# EasyEDA Pro project Homework_1.eprj

# Schematic Schematic1

## Sheets
1 Nguồn: Board Name: Board1; Create Date: 2026-03-27; Page Name: P1; Project Name: Homework_1; Schematic Name: Schematic1; Update Date: 2026-04-17; Company: Lê Huy; Page Size: A4; Version: V1.0
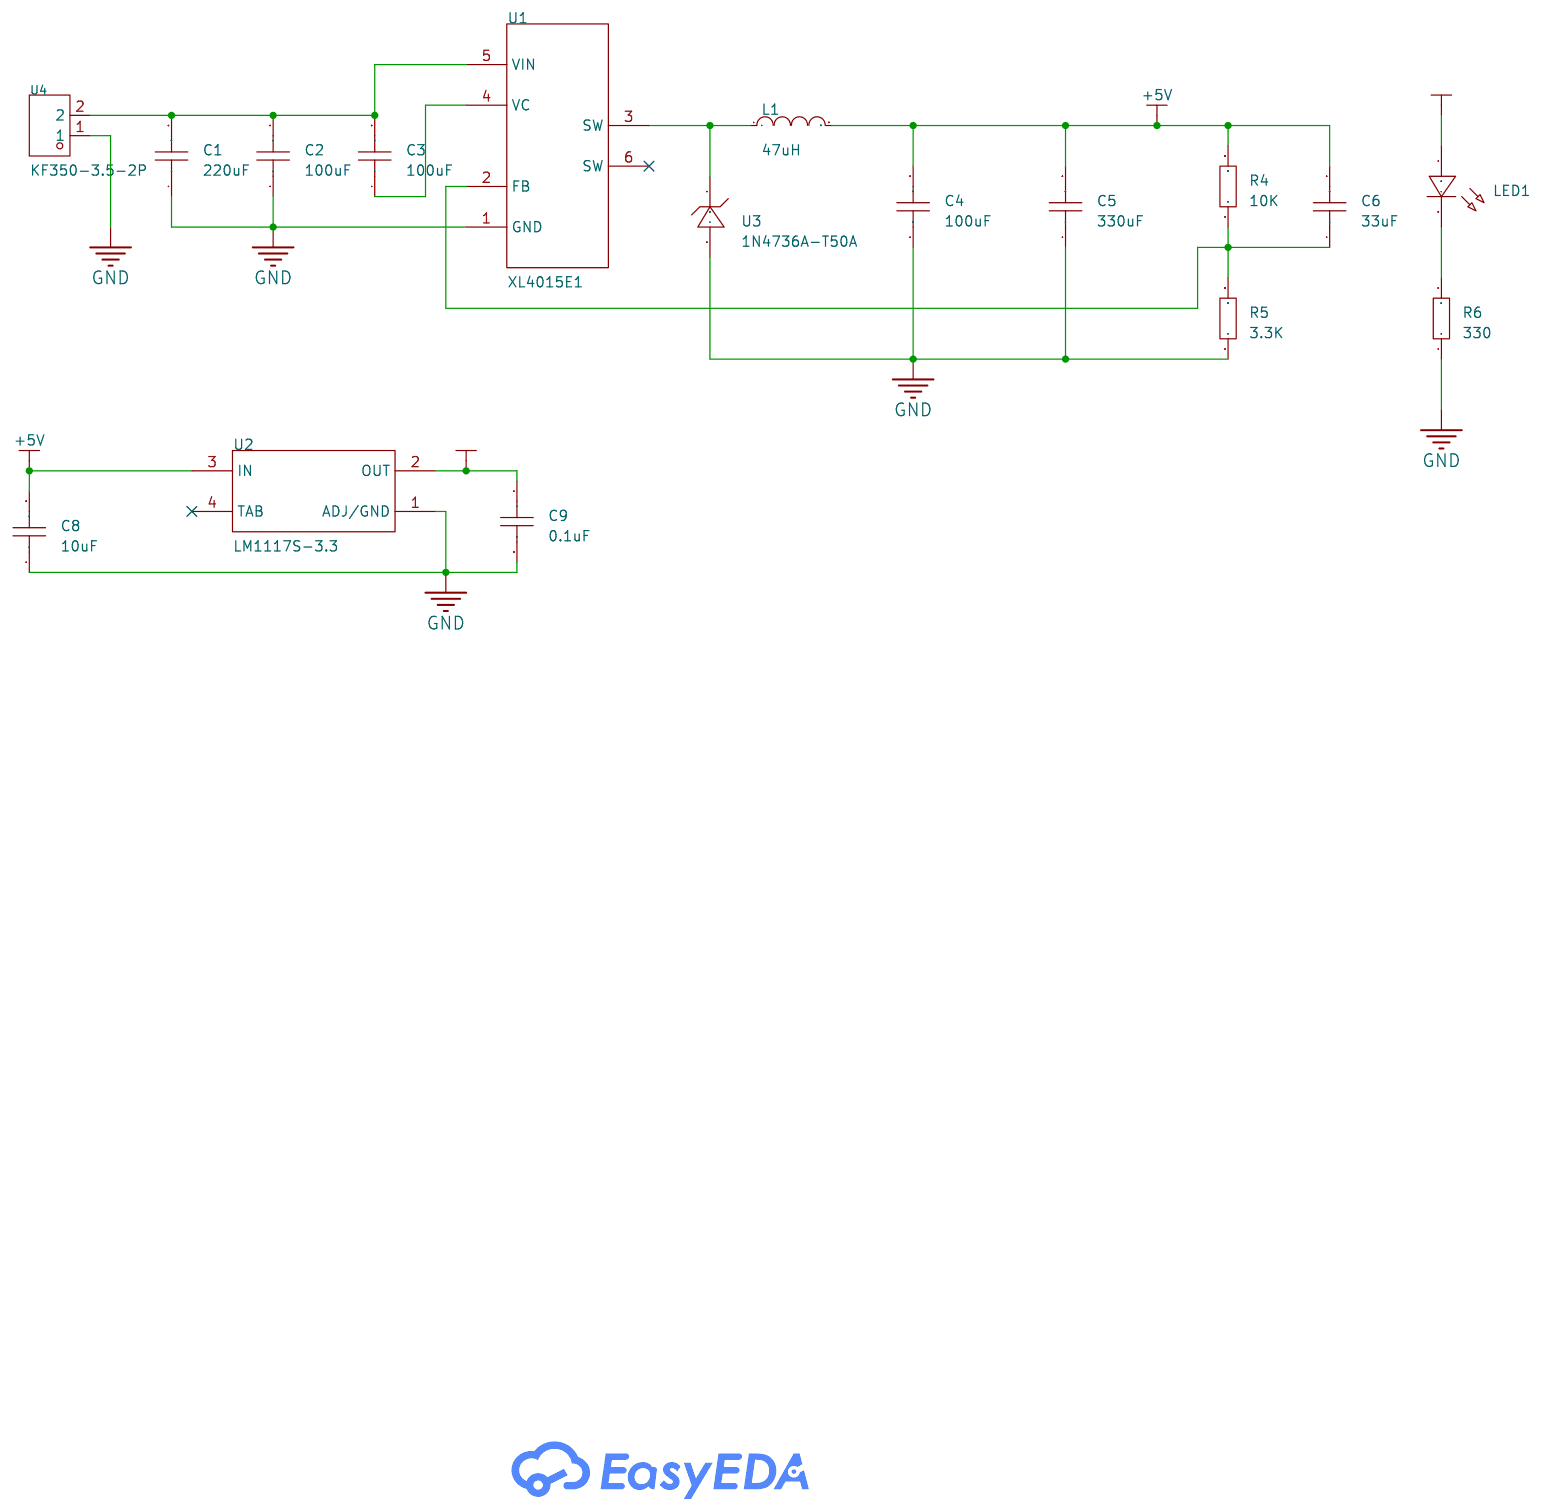
[diagram p0: Nguồn]
2 Não: Create Date: 2026-04-16; Page Name: Não; Update Date: 2026-05-25; Company: EasyEDA.com
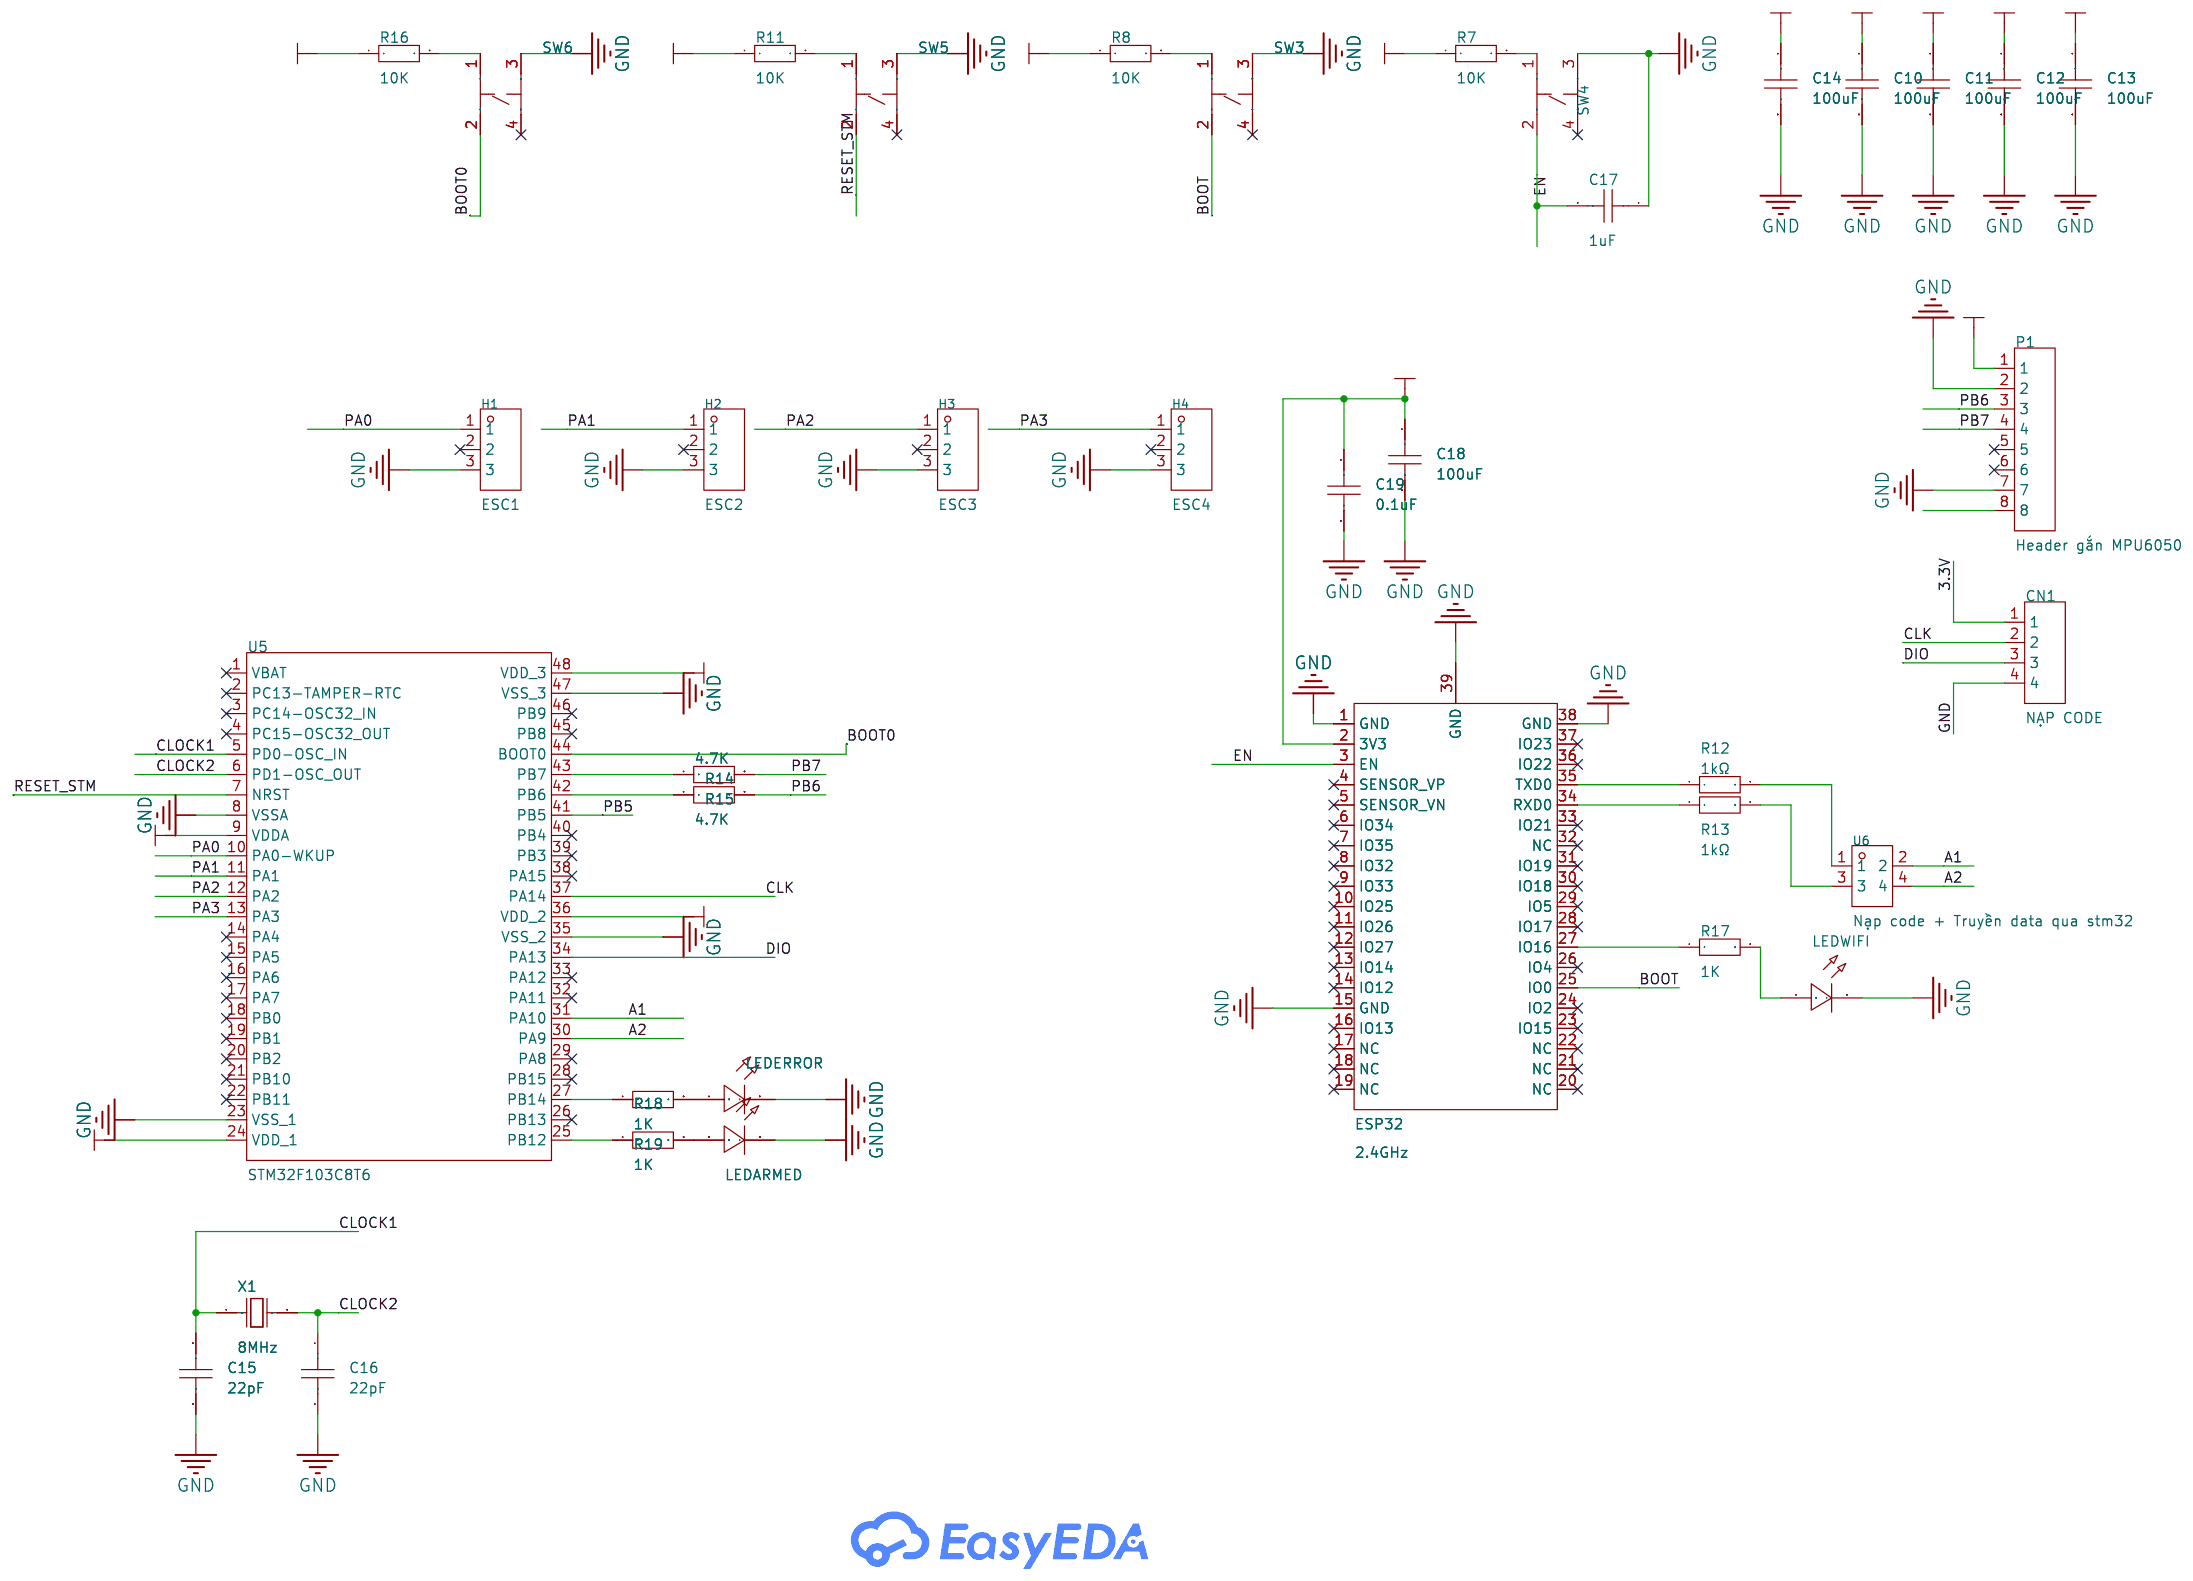
[diagram p1: Não]

## Parts
sheet Nguồn
C1  220uF  [C0805]
C2  100uF  [C0805]
C3  100uF  [C0805]
C4  100uF  [C0805]
C5  330uF  [C0805]
C6  33uF  [C0805]
C8  10uF  [C0805]
C9  0.1uF  [C0805]
L1  47uH  [L0805]
LED1  -  [LED-TH_BD3.0-P2.54-FD]
R4  10K  [R0805]
R5  3.3K  [R0805]
R6  330  [R0805]
U1  XL4015E1  [TO-263-5_L10.2-W8.9-P1.70-TL]
U2  LM1117S-3.3  [SOT-223-3_L6.5-W3.4-P2.30-LS7.0-BR]
U3  1N4736A-T50A  [DO-41_BD2.4-L4.7-P8.70-D0.9-RD]
U4  KF350-3.5-2P  [CONN-TH_P3.50_KF350-3.5-2P]
sheet Não
C10  100uF  [C0805]
C11  100uF  [C0805]
C12  100uF  [C0805]
C13  100uF  [C0805]
C14  100uF  [C0805]
C15  22pF  [C0805]
C16  22pF  [C0805]
C17  1uF  [C0805]
C18  100uF  [C0805]
C19  0.1uF  [C0805]
CN1  NẠP CODE  [CONN-TH_XY-XH2.54-4A11-YT]
ESP32  2.4GHz  [WIFI-SMD_ESP32-WROOM-32E]
H1  ESC1  [HDR-TH_3P-P2.54-V-M-1]
H2  ESC2  [HDR-TH_3P-P2.54-V-M-1]
H3  ESC3  [HDR-TH_3P-P2.54-V-M-1]
H4  ESC4  [HDR-TH_3P-P2.54-V-M-1]
LEDARMED  -  [LED-TH_BD3.0-P2.54-FD]
LEDERROR  -  [LED-TH_BD3.0-P2.54-FD]
LEDWIFI  -  [LED-TH_BD3.0-P2.54-FD]
P1  Header gắn MPU6050  [HDR-TH_8P-P2.54-V-F]
R7  10K  [R0805]
R8  10K  [R0805]
R11  10K  [R0805]
R12  1kΩ  [R_AXIAL-0.4]
R13  1kΩ  [R_AXIAL-0.4]
R14  4.7K  [R0805]
R15  4.7K  [R0805]
R16  10K  [R0805]
R17  1K  [R0805]
R18  1K  [R0805]
R19  1K  [R0805]
SW3  BOOT  [SW-SMD_4P-L6.0-W6.0-P4.50-LS9.0-H7.3]
SW4  SW  [SW-SMD_4P-L6.0-W6.0-P4.50-LS9.0-H7.3]
SW5  BOOT  [SW-SMD_4P-L6.0-W6.0-P4.50-LS9.0-H7.3]
SW6  BOOT  [SW-SMD_4P-L6.0-W6.0-P4.50-LS9.0-H7.3]
U5  STM32F103C8T6  [LQFP-48_L7.0-W7.0-P0.50-LS9.0-BL]
U6  Nạp code + Truyền data qua stm32  [HDR-TH_4P-P2.54-V-M-R2-C2-S2.54]
X1  8MHz  [HC-49S_L11.0-W4.7-P4.88]

## Library data of the parts
C1-C6 C8-C19 = CAP_0805: Supplier Footprint: 0805
L1 = L_0805
LED1 LEDARMED LEDERROR LEDWIFI = LED_TH-R_3mm: Supplier Footprint: Through
R4-R8 R11 R14-R19 = Res_0805: Supplier Footprint: 0805
U1 = XL4015E1: LCSC Part Name: 5A 180KHz 36V 降压型DC-DC转换器; Supplier Part: C51661; Manufacturer: XLSEMI(芯龙); Supplier Footprint: TO-263-5; JLCPCB Part Class: Extended Part; Datasheet: https://item.szlcsc.com/datasheet/XL4015E1/52674.html; Supplier: LCSC; Function: Buck; Voltage - Supply: 8V~36V; Output Voltage: 1.25V~32V; Output Current: 5A; Frequency - Switching: 180kHz; Operating Temperature: -40℃~+125℃; Synchronous Rectifier: No; Number of Outputs: 1; Topology: Buck; Quiescent Current: 5mA; Switch tube (built-in/external): Built-in; Output Type: Adjustable
U2 = LM1117S-3.3: LCSC Part Name: 输入12V 输出3.3V 1A; Supplier Part: C126027; Manufacturer: HTC; Supplier Footprint: SOT-223-3; JLCPCB Part Class: Extended Part; Datasheet: https://item.szlcsc.com/datasheet/LM1117S-3.3/137307.html; Supplier: LCSC; Output Type: Fixed; Voltage - Supply: 12V; Output Voltage: 3.3V; Output Current: 1A; Power Supply Rejection Ratio (PSRR): 75dB@(120Hz); Voltage Dropout: 1.2V@(1A); standby current: 5mA; Noise: 100uV; Features: Over Temperature Protection; Operating Temperature: -40℃~+125℃@(Tj); Output Configuration: Positive; Number of Outputs: 1
U3 = 1N4736A-T50A: LCSC Part Name: Zener 1W 5%; Supplier Part: C890055; Manufacturer: onsemi(安森美); Supplier Footprint: 插件,D2.03xL4.06mm; JLCPCB Part Class: Extended Part; Datasheet: https://atta.szlcsc.com/upload/public/pdf/source/20221020/ED14C0897A7B8AED5ABCCF0A94CC169C.pdf; Supplier: LCSC; Zener Voltage (Nom): 6.8V; Reverse Leakage Current (Ir): 10uA@4V; Power Dissipation: 1W; Zener Impedance (Zzt): 3.5Ω
U4 = KF350-3.5-2P: LCSC Part Name: 3.5mm 1x2P 排数:1 每排P数:2 直插; Supplier Part: C474892; Manufacturer: KEFA(科发); Supplier Footprint: 插件,P=3.5mm; JLCPCB Part Class: Extended Part; Datasheet: https://atta.szlcsc.com/upload/public/pdf/source/20230317/986DB56DD49619EA586AA8816AA9D164.pdf; Supplier: LCSC; Structure: 1x2P; Pitch: 3.5mm; Color: Green; Mounting Style: Straight; Current Rating (Max): 10A; Voltage Rating (Max): 300V; Number of Pins: 2P; Number of Rows: 1; Wire Gauge - AWG: 18~24; Wire Gauge - mm2: 0.75; Number of PINs Per Row: 2; Operating Temperature Range: -40℃~+105℃
CN1 = HC-XH2.54-4A-M: LCSC Part Name: 1x4P 间距:2.5mm 直插 系列:XH; Supplier Part: C53454747; Manufacturer: HC(虹成电子); Supplier Footprint: 插件,P=2.5mm; JLCPCB Part Class: Extended Part; Datasheet: https://item.szlcsc.com/datasheet/HC-XH2.54-4A-M/56613753.html; Supplier: LCSC; Pins Structure: 1x4P; Pitch: 2.5mm; Mounting Type: Through Hole; Reference Series: XH; Number of Pins: 4P; Number of Rows: 1; Number of PINs Per Row: 4; Current Rating: 3A; Contact Material: Copper; Contact Plating: Tin; Operating Temperature: -25℃~+85℃; Voltage Rating: 250V; Plastic Material: PA66; Color: Beige; Z-Height of the Board: 7mm; X-Length of Bottom Edge on Board (Spacing Line): 12.5mm; Y-Width of Bottom Edge on Board: 5.8mm
ESP32 = ESP32-WROOM-32E-N4: LCSC Part Name: 不带固件 通用型Wi-Fi+BT+BLE MCU模组; Supplier Part: C701341; Manufacturer: ESPRESSIF(乐鑫); Supplier Footprint: SMD,25.5x18mm; JLCPCB Part Class: Extended Part; Datasheet: https://item.szlcsc.com/datasheet/ESP32-WROOM-32E-N4/736349.html; Supplier: LCSC; Utilized IC / Part: ESP32-D0WDR2-V3；ESP32-D0WD-V3; Wireless Standard: Bluetooth4.2; Interface Type: I2C；GPIO；UART；SPI；SDIO; Antenna Type: On-board PCB Antenna; Output Power: 20dBm; Voltage - Supply: 3V~3.6V; Receive  Current: 112mA; Send  Current: 239mA; Sensitivity: -98dBm; Operating Temperature: -40℃~+85℃
H1-H4 = 2.54-1*3: LCSC Part Name: 停产 1x3P 间距:2.54mm 方针 直插; Supplier Part: C5116482; Manufacturer: ZHOURI(洲日); Supplier Footprint: 插件,P=2.54mm; JLCPCB Part Class: Extended Part; Datasheet: https://item.szlcsc.com/datasheet/2.54-1*3/5692725.html; Supplier: LCSC; Pin Structure: 1x3P; Pitch: 2.54mm; Circluar Pins/Square Pins: Pin Header; Mounting Type: Through Hole; Number of Rows: 1; Number of Pins: 3P; Current Rating: 2.5A; Length of Mating Pin: 6mm; Insulation Height: 2.54mm; Length of End Connection Pin: 3mm; Contact Material: Brass; Contact Plating: Gold; Operating Temperature: -40℃~+105℃
P1 = 2.54-1*8P母环保: LCSC Part Name: 1x8P 间距:2.54mm 直插; Supplier Part: C27438; Manufacturer: BOOMELE(博穆精密); Supplier Footprint: 插件,P=2.54mm; JLCPCB Part Class: Extended Part; Datasheet: https://item.szlcsc.com/datasheet/2.54-1*8P%25E6%25AF%258D%25E7%258E%25AF%25E4%25BF%259D/28187.html; Supplier: LCSC; Holes Structure: 1x8P; Pitch: 2.54mm; Circular Hole / Square Hole: Square Hole; Mounting Type: Through Hole; Number of Rows: 1; Number of Positions: 8P; Current Rating: 3A; Holes Direction: Top; Insulation Height: 8.5mm; Contact Material: Brass; Contact Plating: Gold; Operating Temperature: -55℃~+105℃; PIN Length: 3.2mm
R12 R13 = Res_AXIAL-1/4W: Supplier Footprint: Through
SW3-SW6 = HX-6x6x7.3-TP FT square button: LCSC Part Name: 6*6*7.3mm贴片 方头 轻触开关; Supplier Part: C49234152; Manufacturer: hanxia(韩下); Supplier Footprint: SMD,6x6mm; JLCPCB Part Class: Extended Part; Datasheet: https://item.szlcsc.com/datasheet/HX-6x6x7.3-TP%2520FT%2520square%2520button/51650213.html; Supplier: LCSC; Circuit: SPST; Actuator Style: Round Button; Operating Force: 2.5N; Mounting Type: Surface Mount,Vertical; Length: 6mm; Width: 6mm; Switch Height: 7.3mm; with Bracket: Without Bracket; Contact Current: 50mA; Voltage Rating: 250V; Actuator/Cap Color: Black; With Lamp: No; Termination Style: SMD(SMT) Tab; Life: 100,000 Cycles; Operating Temperature: -25℃~+70℃
U5 = STM32F103C8T6: LCSC Part Name: 主流增强型ARM Cortex-M3 MCU，具有64 KB Flash、72 MHz CPU、电机控制、USB和CAN; Supplier Part: C8734; Manufacturer: ST(意法半导体); Supplier Footprint: LQFP-48(7x7); JLCPCB Part Class: Extended Part; Datasheet: https://item.szlcsc.com/datasheet/STM32F103C8T6/9243.html; Supplier: LCSC; CPU Core: ARM-M3; CPU Maximum Speed: 72MHz; Program Storage Size: 64KB; Program Memory Type: FLASH; Number of I/O: 37; ADC (Bit): 12bit; Voltage - Supply: 2V~3.6V
U6 = PZ2.54-2*2: LCSC Part Name: 2x2P 间距:2.54mm 方针 直插; Supplier Part: C5156675; Manufacturer: ZHOURI(洲日); Supplier Footprint: 插件,P=2.54mm; JLCPCB Part Class: Extended Part; Datasheet: https://item.szlcsc.com/datasheet/PZ2.54-2*2/5790844.html; Supplier: LCSC; Pin Structure: 2x2P; Pitch: 2.54mm; Row Spacing: 2.54mm; Circluar Pins/Square Pins: Pin Header; Mounting Type: Through Hole; Number of Rows: 2; Number of Pins: 4P; Current Rating: 2.5A; Length of Mating Pin: 6mm; Insulation Height: 2.54mm; Length of End Connection Pin: 3mm; Contact Material: Brass; Contact Plating: Gold; Operating Temperature: -40℃~+105℃
X1 = 049ST2-8.000F16HPNLL: LCSC Part Name: NJHP HC-49S 2P 8MHz 16pF ±10ppm -20~+70℃(±30ppm); Supplier Part: C46598389; Manufacturer: HCI(杭晶); Supplier Footprint: HC-49S-2P; JLCPCB Part Class: Extended Part; Datasheet: https://item.szlcsc.com/datasheet/049ST2-8.000F16HPNLL/48741025.html; Supplier: LCSC; Type: Through Hole Crystal Oscillator; Normal temperature Frequency Tolerance: ±10ppm; Load Capacitance: 16pF; Frequency Stability: ±20ppm; Equivalent Series Resistance(ESR): 60Ω; Operating Temperature: -20℃~+70℃

## Nets
3.3V: C9.1 C10.1 C11.1 C12.1 C13.1 C14.1 C18.1 C19.1 CN1.1 ESP32.2(3V3) LED1.1(C) P1.1 R7.1 R8.1 R11.1 R16.1 U2.2(OUT) U5.9(VDDA) U5.24(VDD_1) U5.36(VDD_2) U5.48(VDD_3)
+5V: C4.2 C5.2 C6.2 C8.2 L1.2 R4.2 U2.3(IN)
GND: C1.1 C2.1 C4.1 C5.1 C8.1 C9.2 C10.2 C11.2 C12.2 C13.2 C14.2 C15.2 C16.2 C17.1 C18.2 C19.2 CN1.4 ESP32.1(GND) ESP32.15(GND) ESP32.38(GND) ESP32.39(GND) H1.3 H2.3 H3.3 H4.3 LEDARMED.2(A) LEDERROR.2(A) LEDWIFI.2(A) P1.2 P1.7 R5.1 R6.1 SW3.3(C) SW4.3(C) SW5.3(C) SW6.3(C) U1.1(GND) U2.1(ADJ/GND) U3.2(A) U4.1 U5.8(VSSA) U5.23(VSS_1) U5.35(VSS_2) U5.47(VSS_3)
A1: U5.31(PA10) U6.2
A2: U5.30(PA9) U6.4
BOOT: ESP32.25(IO0) SW3.2(B)
BOOT0: SW6.2(B) U5.44(BOOT0)
CLK: CN1.2 U5.37(PA14)
CLOCK1: C15.1 U5.5(PD0-OSC_IN) X1.1(OSC1)
CLOCK2: C16.1 U5.6(PD1-OSC_OUT) X1.2(OSC2)
DIO: CN1.3 U5.34(PA13)
EN: C17.2 ESP32.3(EN) SW4.2(B)
PA0: H1.1 U5.10(PA0-WKUP)
PA1: H2.1 U5.11(PA1)
PA2: H3.1 U5.12(PA2)
PA3: H4.1 U5.13(PA3)
PB5: U5.41(PB5)
PB6: P1.3 R15.2
PB7: P1.4 R14.2
RESET_STM: SW5.2(B) U5.7(NRST)
$1N753: C1.2 C2.2 C3.2 U1.5(VIN) U4.2
$1N844: C3.1 U1.4(VC)
$1N850: L1.1 U1.3(SW) U3.1(C)
$1N1078: C6.1 R4.1 R5.2 U1.2(FB)
$1N1506: LED1.2(A) R6.2
$2N3717: ESP32.35(TXD0) R12.1
$2N3721: ESP32.34(RXD0) R13.1
$2N4329: R8.2 SW3.1(A)
$2N4589: R7.2 SW4.1(A)
$2N4702: R11.2 SW5.1(A)
$2N7245: R12.2 U6.1
$2N7250: R13.2 U6.3
$2N8541: R14.1 U5.43(PB7)
$2N8545: R15.1 U5.42(PB6)
$2N11841: R16.2 SW6.1(A)
$2N11851: ESP32.27(IO16) R17.1
$2N11902: LEDWIFI.1(C) R17.2
$2N12058: LEDERROR.1(C) R18.2
$2N12127: LEDARMED.1(C) R19.2
$2N12132: R18.1 U5.27(PB14)
$2N12136: R19.1 U5.25(PB12)

Not connected (* = marked no-connect by the designer): ESP32 4(SENSOR_VP)* 5(SENSOR_VN)* 6(IO34)* 7(IO35)* 8(IO32)* 9(IO33)* 10(IO25)* 11(IO26)* 12(IO27)* 13(IO14)* 14(IO12)* 16(IO13)* 17(NC)* 18(NC)* 19(NC)* 20(NC)* 21(NC)* 22(NC)* 23(IO15)* 24(IO2)* 26(IO4)* 28(IO17)* 29(IO5)* 30(IO18)* 31(IO19)* 32(NC)* 33(IO21)* 36(IO22)* 37(IO23)*; H1 2*; H2 2*; H3 2*; H4 2*; P1 5* 6* 8; SW3 4(D)*; SW4 4(D)*; SW5 4(D)*; SW6 4(D)*; U1 6(SW)*; U2 4(TAB)*; U5 1(VBAT)* 2(PC13-TAMPER-RTC)* 3(PC14-OSC32_IN)* 4(PC15-OSC32_OUT)* 14(PA4)* 15(PA5)* 16(PA6)* 17(PA7)* 18(PB0)* 19(PB1)* 20(PB2)* 21(PB10)* 22(PB11)* 26(PB13)* 28(PB15)* 29(PA8)* 32(PA11)* 33(PA12)* 38(PA15)* 39(PB3)* 40(PB4)* 45(PB8)* 46(PB9)*

# Board PCB5
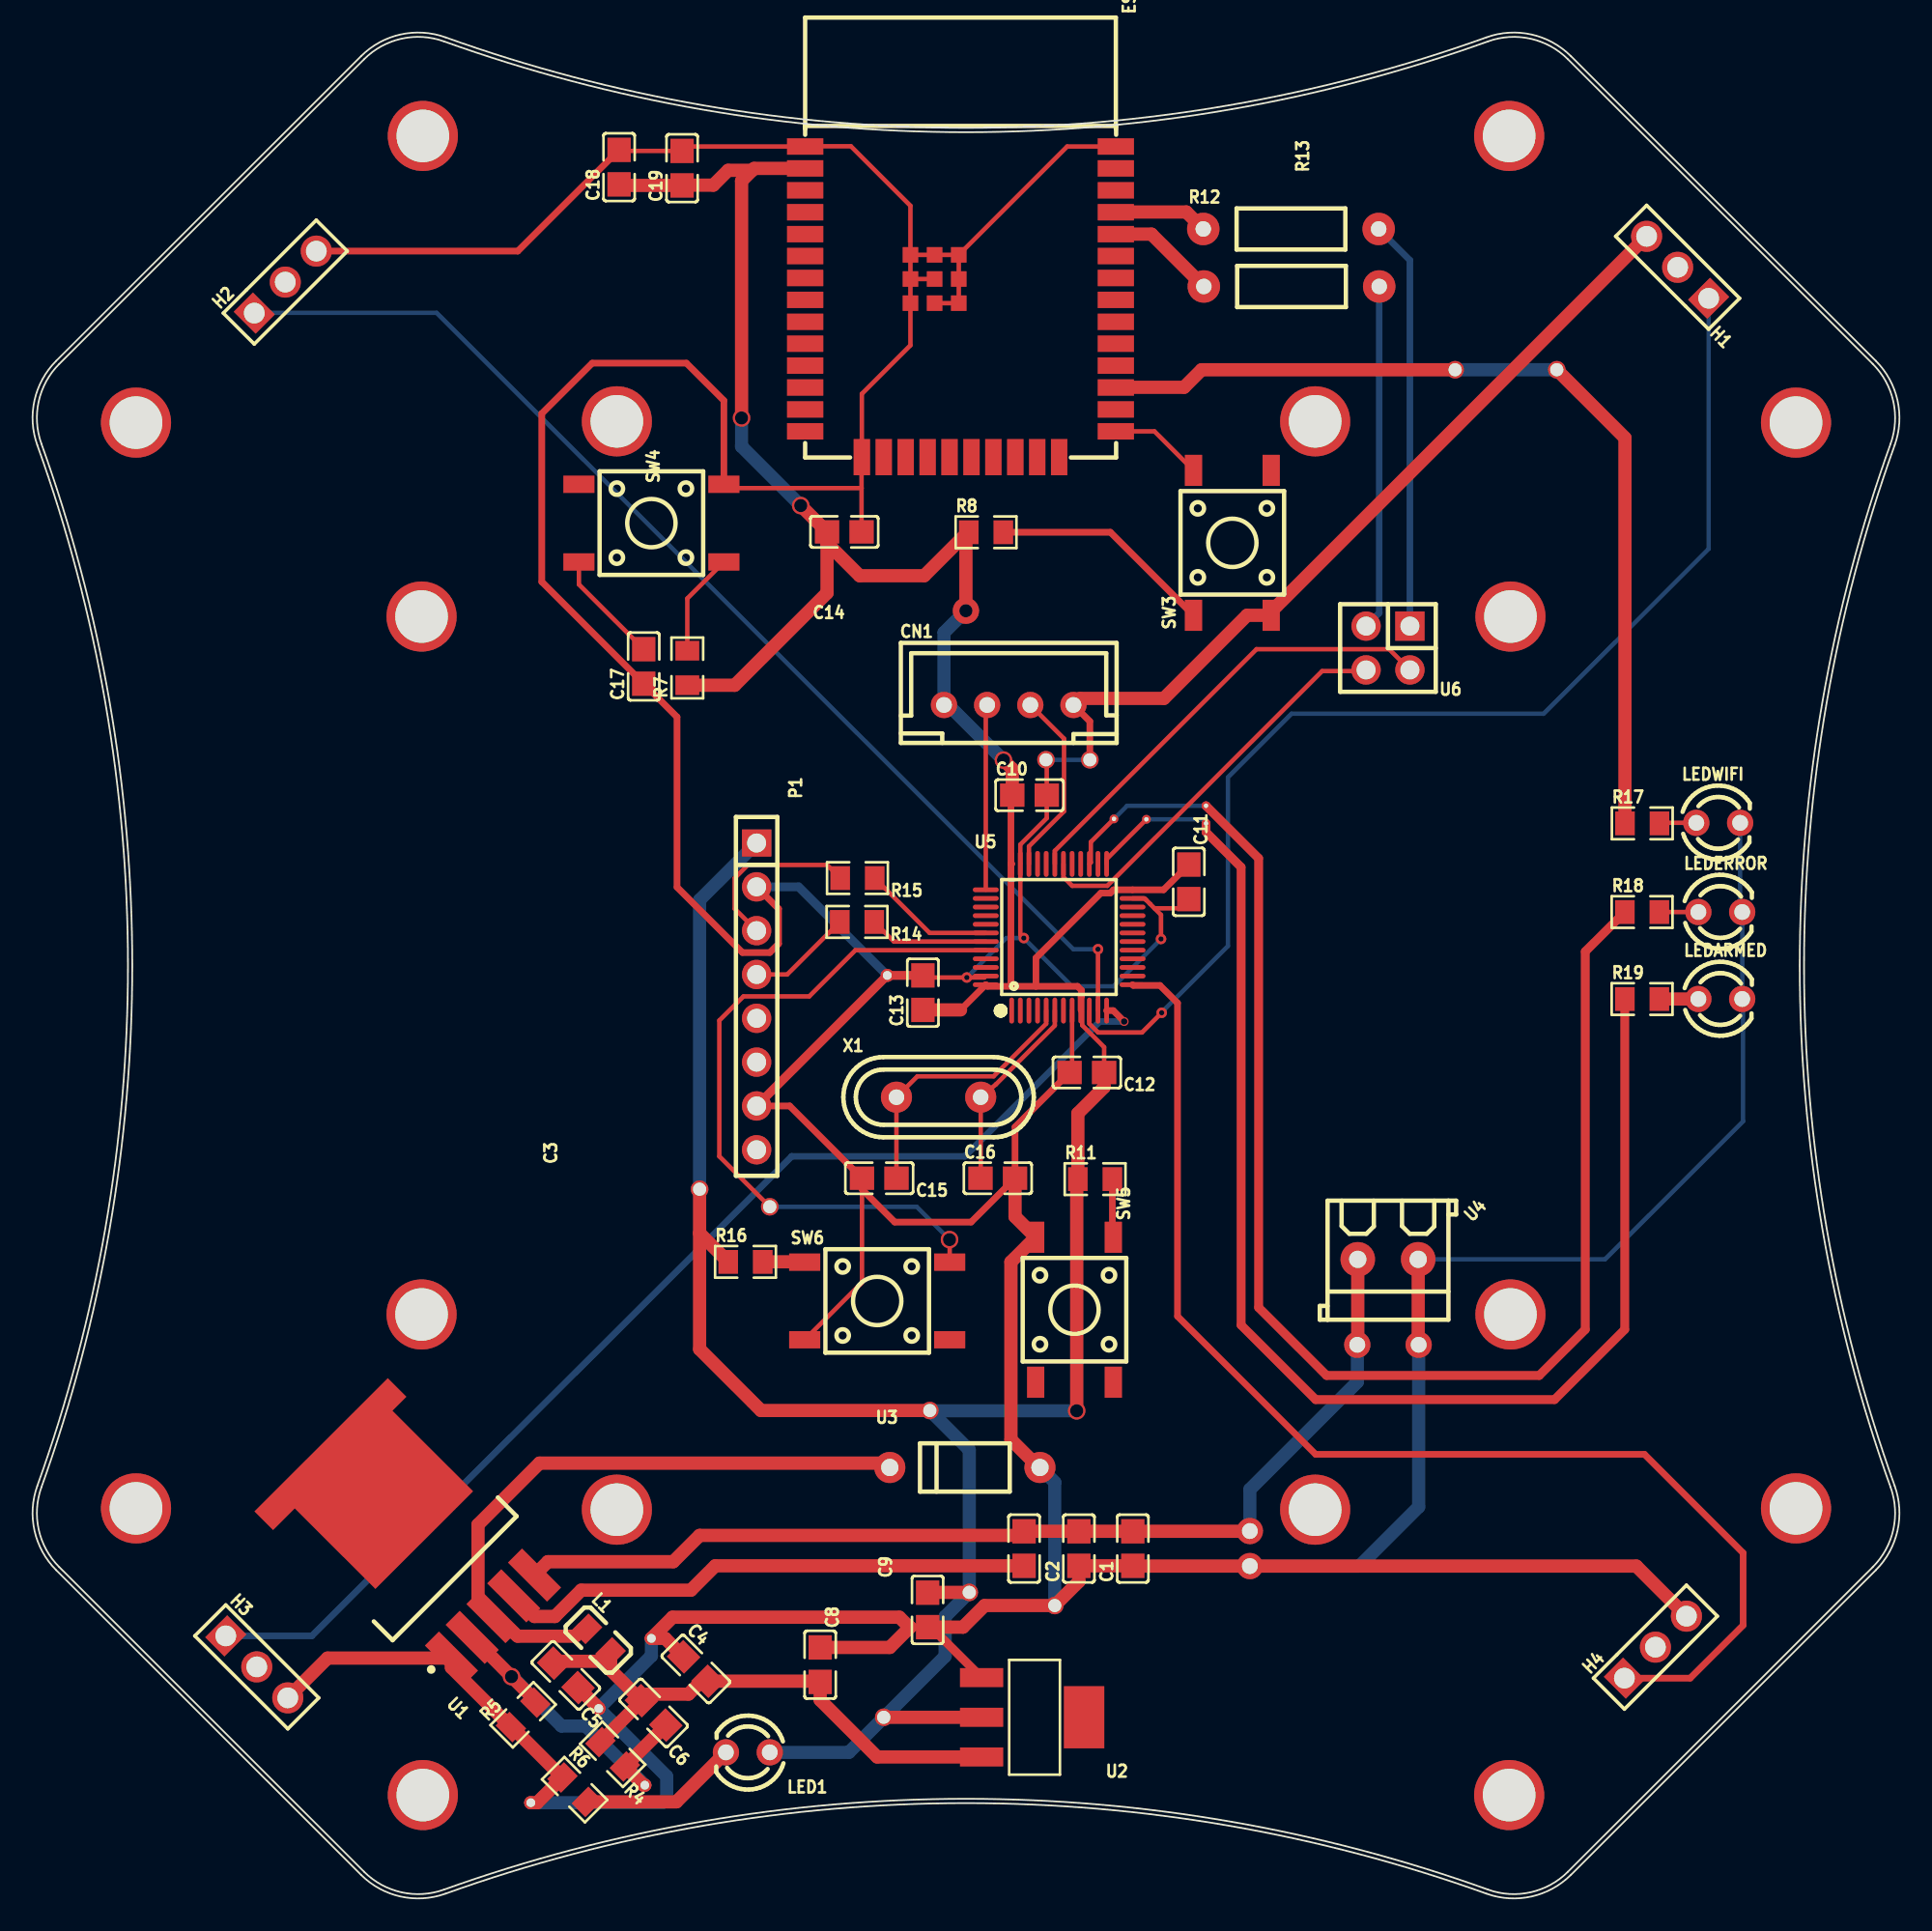
[diagram p2: board, top side]
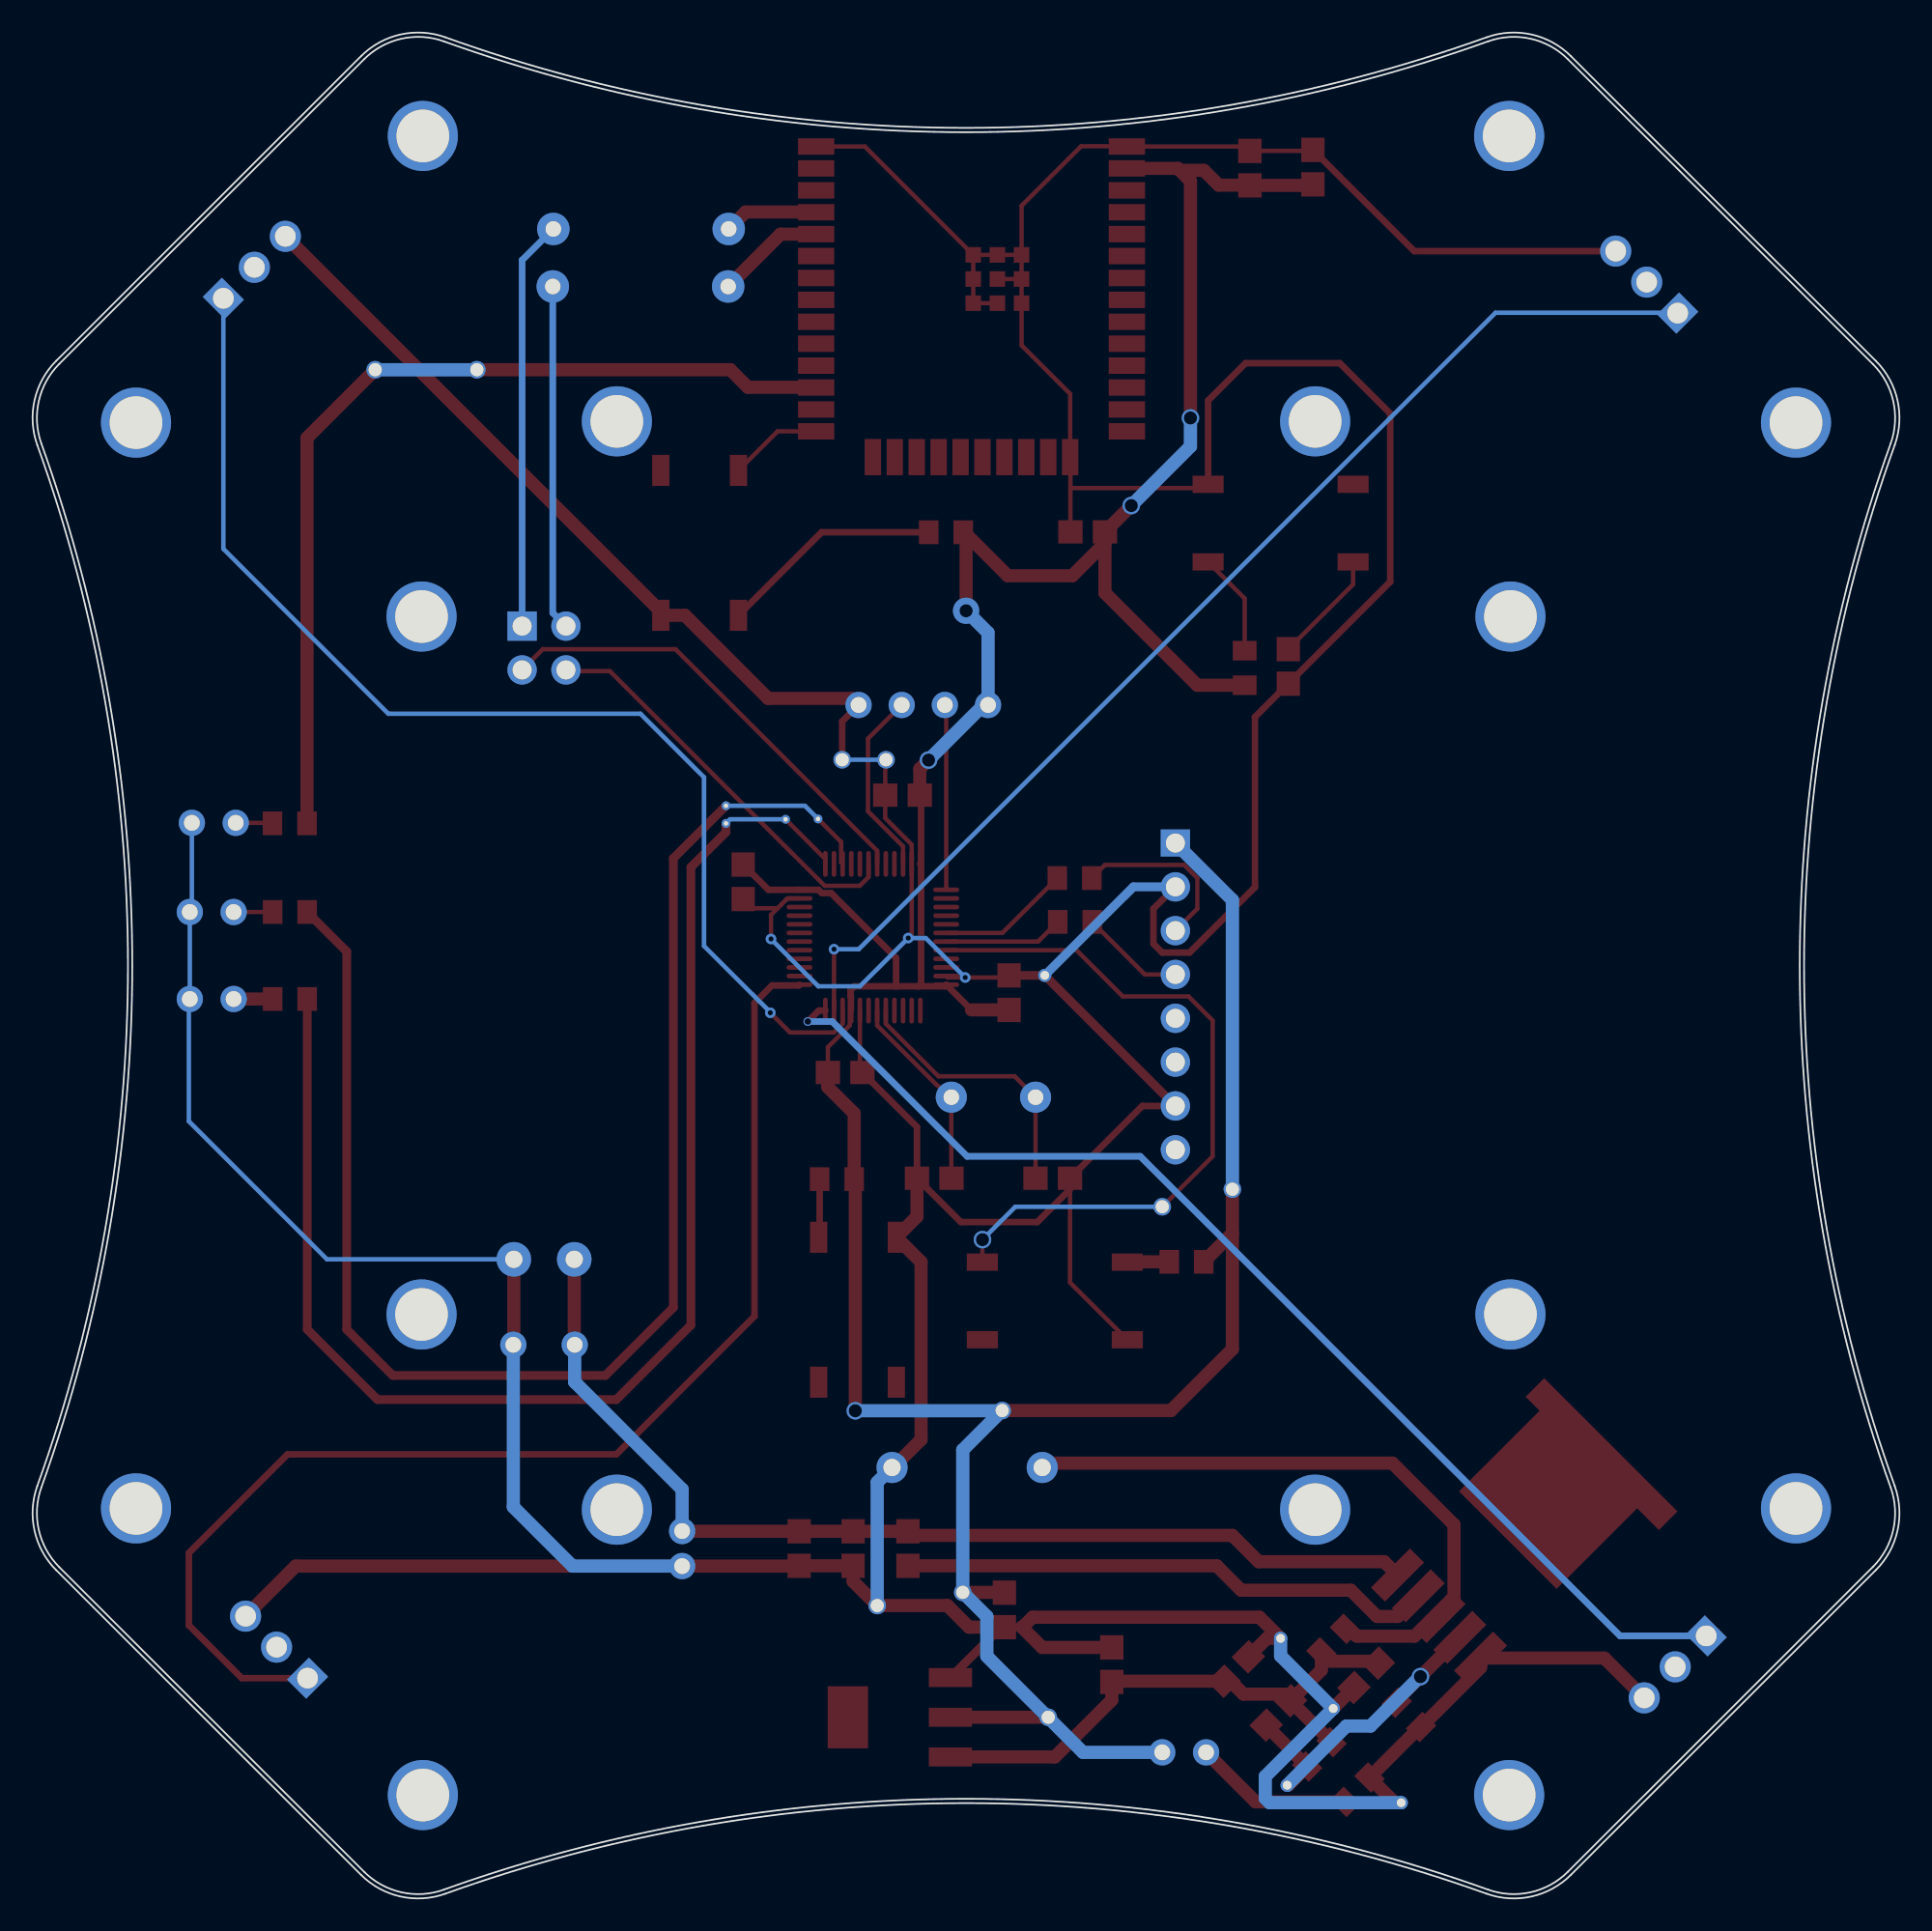
[diagram p3: board, bottom side, seen from below]

Outline 108.15 x 108.15 mm; copper layers: Top Layer, Bottom Layer. Coordinates in mm from the lower left corner of the outline.
Outline path: 0.27,84.23 arc(5.52,54.07) 0.27,23.91 arc(0.11,21.31) 1.37,19.03 19.03,1.37 arc(21.31,0.11) 23.91,0.27 arc(54.07,5.52) 84.23,0.27 arc(86.83,0.11) 89.12,1.37 106.78,19.03 arc(108.03,21.31) 107.87,23.91 arc(102.62,54.07) 107.87,84.23 arc(108.03,86.83) 106.78,89.12 89.12,106.78 arc(86.83,108.03) 84.23,107.87 arc(54.07,102.62) 23.91,107.87 arc(21.31,108.03) 19.03,106.78 1.37,89.12 arc(0.11,86.83) 0.27,84.23 ; 0.51,84.32 arc(5.77,54.07) 0.51,23.83 arc(0.35,21.36) 1.54,19.2 19.2,1.54 arc(21.36,0.35) 23.83,0.51 arc(54.07,5.77) 84.32,0.51 arc(86.78,0.35) 88.94,1.54 106.6,19.2 arc(107.79,21.36) 107.64,23.83 arc(102.37,54.07) 107.64,84.32 arc(107.79,86.78) 106.6,88.94 88.94,106.6 arc(86.78,107.79) 84.32,107.64 arc(54.07,102.37) 23.83,107.64 arc(21.36,107.79) 19.2,106.6 1.54,88.94 arc(0.35,86.78) 0.51,84.32
Stack: Top Layer 0.035mm / Dielectric1 1.51mm FR4 er 4.5 / Bottom Layer 0.035mm

## Design rules (mm)
template: Custom Config
spacing copperThickness1oz (default): track to track 0.102, other pairs 0.152 to 0.3
spacing copperThickness2oz: track to track 0.203, other pairs 0.152 to 0.3
track width copperThickness1oz (default): min 0.127, default 0.254, max 2.54
track width copperThickness2oz: min 0.203, default 0.254, max 2.54
differential pair differentialPair (default): width min 0.127, default 0.254, max 2.54; gap min 0.152, default 0.152
via viaSize (default): diameter min 0.5, default 0.61, max 10; hole min 0.3, default 0.305, max 6.3

## Placement (name value [footprint] x y rotation side)
C1  220uF  [C0805]  63.74 20.28 90 top
C2  100uF  [C0805]  60.61 20.28 90 top
C3  100uF  [C0805]  57.44 20.28 90 top
C4  100uF  [C0805]  38.42 13.29 315 top
C5  330uF  [C0805]  30.89 12.93 135 top
C6  33uF  [C0805]  35.97 10.75 135 top
C8  10uF  [C0805]  45.63 13.55 270 top
C9  0.1uF  [C0805]  51.85 16.72 270 top
C10  100uF  [C0805]  57.75 63.95 0 top
C11  100uF  [C0805]  66.98 58.92 270 top
C12  100uF  [C0805]  61.07 47.87 180 top
C13  100uF  [C0805]  51.58 52.5 90 top
C14  100uF  [C0805]  47.02 79.2 0 top
C15  22pF  [C0805]  49.05 41.74 180 top
C16  22pF  [C0805]  55.91 41.74 0 top
C17  1uF  [C0805]  35.4 71.41 90 top
C18  100uF  [C0805]  33.97 100.35 90 top
C19  0.1uF  [C0805]  37.62 100.29 90 top
CN1  NẠP CODE  [CONN-TH_XY-XH2.54-4A11-YT]  56.55 69.17 0 top
ESP32  2.4GHz  [WIFI-SMD_ESP32-WROOM-32E]  53.75 92.54 270 top
H1  ESC1  [HDR-TH_3P-P2.54-V-M-1]  95.3 94.54 135 top
H2  ESC2  [HDR-TH_3P-P2.54-V-M-1]  14.64 93.68 45 top
H3  ESC3  [HDR-TH_3P-P2.54-V-M-1]  12.99 13.42 315 top
H4  ESC4  [HDR-TH_3P-P2.54-V-M-1]  94.01 14.56 45 top
L1  47uH  [L0805]  32.8 14.94 315 top
LED1  -  [LED-TH_BD3.0-P2.54-FD]  41.43 8.47 180 top
LEDARMED  -  [LED-TH_BD3.0-P2.54-FD]  97.77 52.13 0 top
LEDERROR  -  [LED-TH_BD3.0-P2.54-FD]  97.77 57.17 0 top
LEDWIFI  -  [LED-TH_BD3.0-P2.54-FD]  97.65 62.34 0 top
NOREF  -  [Pad_e674]  51.98 28.28 0 top
NOREF#2  -  [Pad_e3512]  22.53 74.3 45 top
NOREF#3  -  [Pad_e3507]  33.85 22.53 45 top
NOREF#4  -  [Pad_e134]  58.71 66 0 top
NOREF#5  -  [Pad_e219]  82.41 88.6 0 top
NOREF#6  -  [Pad_e3502]  102.16 22.61 45 top
NOREF#7  -  [Pad_e78]  64.52 62.55 0 top
NOREF#8  -  [Pad_e141]  70.52 21.29 0 top
NOREF#9  -  [Pad_e3514]  22.61 102.16 45 top
NOREF#10  -  [Pad_e3517]  5.99 85.54 45 top
NOREF#11  -  [Pad_e3498]  85.54 102.16 45 top
NOREF#12  -  [Pad_e3506]  74.3 22.53 45 top
NOREF#13  -  [Pad_e61]  62.64 62.57 0 top
NOREF#14  -  [Pad_e26454]  35.85 15.07 0 top
NOREF#15  -  [Pad_e3501]  85.61 33.85 45 top
NOREF#16  -  [Pad_e140]  61.25 66 0 top
NOREF#17  -  [Pad_e446]  49.31 10.5 0 top
NOREF#18  -  [Pad_e122]  67.98 63.33 0 top
NOREF#19  -  [Pad_e3500]  102.16 85.54 45 top
NOREF#20  -  [Pad_e191]  88.3 88.6 0 top
NOREF#21  -  [Pad_e123]  67.98 62.31 0 top
NOREF#22  -  [Pad_e26461]  35.47 6.56 0 top
NOREF#23  -  [Pad_e269]  54.26 17.74 0 top
NOREF#24  -  [Pad_e678]  38.64 41.1 0 top
NOREF#25  -  [Pad_e3513]  33.85 85.61 45 top
NOREF#26  -  [Pad_e295]  42.7 40.09 0 top
NOREF#27  -  [Pad_e3508]  22.53 33.85 45 top
NOREF#28  -  [Pad_e26470]  28.86 5.54 0 top
NOREF#29  -  [Pad_e3495]  74.3 85.61 45 top
NOREF#30  -  [Pad_e26541]  49.51 53.5 0 top
NOREF#31  -  [Pad_e26450]  32.8 11.01 0 top
NOREF#32  -  [Pad_e3503]  85.54 5.99 45 top
NOREF#33  -  [Pad_e260]  59.21 16.97 0 top
NOREF#34  -  [Pad_e77]  80.3 32.09 0 top
NOREF#35  -  [Pad_e145]  70.52 19.26 0 top
NOREF#36  -  [Pad_e3510]  22.61 5.99 45 top
NOREF#37  -  [Pad_e69]  76.74 32.09 0 top
NOREF#38  -  [Pad_e3050]  85.61 74.3 45 top
NOREF#39  -  [Pad_e3509]  5.99 22.61 45 top
P1  Header gắn MPU6050  [HDR-TH_8P-P2.54-V-F]  41.94 52.28 270 top
R4  10K  [R0805]  33.6 8.35 135 top
R5  3.3K  [R0805]  28.42 10.64 45 top
R6  330  [R0805]  31.4 6.3 315 top
R7  10K  [R0805]  37.93 71.32 90 top
R8  10K  [R0805]  55.23 79.18 0 top
R11  10K  [R0805]  61.55 41.69 0 top
R12  1kΩ  [R_AXIAL-0.4]  72.9 96.76 0 top
R13  1kΩ  [R_AXIAL-0.4]  72.93 93.43 0 top
R14  4.7K  [R0805]  47.76 56.6 180 top
R15  4.7K  [R0805]  47.78 59.14 180 top
R16  10K  [R0805]  41.3 36.9 0 top
R17  1K  [R0805]  93.25 62.31 0 top
R18  1K  [R0805]  93.24 57.17 0 top
R19  1K  [R0805]  93.24 52.13 0 top
SW3  BOOT  [SW-SMD_4P-L6.0-W6.0-P4.50-LS9.0-H7.3]  69.5 78.57 90 top
SW4  SW  [SW-SMD_4P-L6.0-W6.0-P4.50-LS9.0-H7.3]  35.85 79.71 180 top
SW5  BOOT  [SW-SMD_4P-L6.0-W6.0-P4.50-LS9.0-H7.3]  60.36 34.12 270 top
SW6  BOOT  [SW-SMD_4P-L6.0-W6.0-P4.50-LS9.0-H7.3]  48.93 34.63 0 top
U1  XL4015E1  [TO-263-5_L10.2-W8.9-P1.70-TL]  23.13 19.88 135 top
U2  LM1117S-3.3  [SOT-223-3_L6.5-W3.4-P2.30-LS7.0-BR]  57.94 10.5 180 top
U3  1N4736A-T50A  [DO-41_BD2.4-L4.7-P8.70-D0.9-RD]  54.01 24.98 0 top
U4  KF350-3.5-2P  [CONN-TH_P3.50_KF350-3.5-2P]  78.52 37.04 180 top
U5  STM32F103C8T6  [LQFP-48_L7.0-W7.0-P0.50-LS9.0-BL]  59.47 55.71 0 top
U6  Nạp code + Truyền data qua stm32  [HDR-TH_4P-P2.54-V-M-R2-C2-S2.54]  78.52 72.47 180 top
X1  8MHz  [HC-49S_L11.0-W4.7-P4.88]  52.48 46.44 0 top

## Footprints (pads in the part's own frame, mm; a bottom-side part is the same pattern mirrored in y, then rotated)
C0805
  rect 1.41x1.35 smd: 1(-1,0) 2(1,0)
CONN-TH_P3.50_KF350-3.5-2P
  round 2 hole 1: 1(-1.75,0) 2(1.75,0)
CONN-TH_XY-XH2.54-4A11-YT
  round 1.524 hole 0.914: 1(-3.75,0) 2(-1.25,0) 3(1.25,0) 4(3.75,0)
DO-41_BD2.4-L4.7-P8.70-D0.9-RD
  round 1.8 hole 1: 1(-4.35,0) 2(4.35,0)
HC-49S_L11.0-W4.7-P4.88
  round 1.8 hole 0.9: 1(-2.44,0) 2(2.44,0)
HDR-TH_3P-P2.54-V-M-1
  rect 1.575x1.8 hole 1.2: 1(-2.54,0)
  round 1.8 hole 1.2: 2(0,0) 3(2.54,0)
HDR-TH_4P-P2.54-V-M-R2-C2-S2.54
  rect 1.7x1.7 hole 1.1: 1(-1.27,-1.27)
  round 1.7 hole 1.1: 2(-1.27,1.27) 3(1.27,-1.27) 4(1.27,1.27)
HDR-TH_8P-P2.54-V-F
  rect 1.575x1.7 hole 1.1: 1(-8.89,0)
  round 1.7 hole 1.1: 2(-6.35,0) 3(-3.81,0) 4(-1.27,0) 5(1.27,0) 6(3.81,0) 7(6.35,0) 8(8.89,0)
L0805
  rect 1.133x1.377 smd: 1(-0.966,0) 2(0.966,0)
LED-TH_BD3.0-P2.54-FD
  round 1.524 hole 0.914: 1(-1.27,0) 2(1.27,0)
LQFP-48_L7.0-W7.0-P0.50-LS9.0-BL
  oval 0.27x1.5 smd: 1(-2.75,-4.25) 2(-2.25,-4.25) 3(-1.75,-4.25) 4(-1.25,-4.25) 5(-0.75,-4.25) 6(-0.25,-4.25) 7(0.25,-4.25) 8(0.75,-4.25) 9(1.25,-4.25) 10(1.75,-4.25) 11(2.25,-4.25) 12(2.75,-4.25) 25(2.75,4.25) 26(2.25,4.25) 27(1.75,4.25) 28(1.25,4.25) 29(0.75,4.25) 30(0.25,4.25) 31(-0.25,4.25) 32(-0.75,4.25) 33(-1.25,4.25) 34(-1.75,4.25) 35(-2.25,4.25) 36(-2.75,4.25)
  oval 1.5x0.27 smd: 13(4.25,-2.75) 14(4.25,-2.25) 15(4.25,-1.75) 16(4.25,-1.25) 17(4.25,-0.75) 18(4.25,-0.25) 19(4.25,0.25) 20(4.25,0.75) 21(4.25,1.25) 22(4.25,1.75) 23(4.25,2.25) 24(4.25,2.75) 37(-4.25,2.75) 38(-4.25,2.25) 39(-4.25,1.75) 40(-4.25,1.25) 41(-4.25,0.75) 42(-4.25,0.25) 43(-4.25,-0.25) 44(-4.25,-0.75) 45(-4.25,-1.25) 46(-4.25,-1.75) 47(-4.25,-2.25) 48(-4.25,-2.75)
Pad_e61
  round 0.508 hole 0.254: 1(0,0)
Pad_e69
  round 1.524 hole 0.914: 1(0,0)
Pad_e77
  round 1.524 hole 0.914: 2(0,0)
Pad_e78
  round 0.508 hole 0.254: 2(0,0)
Pad_e122
  round 0.508 hole 0.254: 1(0,0)
Pad_e123
  round 0.508 hole 0.254: 2(0,0)
Pad_e134
  round 1.016 hole 0.762: 1(0,0)
Pad_e140
  round 1.016 hole 0.762: 1(0,0)
Pad_e141
  round 1.524 hole 0.914: 1(0,0)
Pad_e145
  round 1.524 hole 0.914: 2(0,0)
Pad_e191
  round 1.016 hole 0.762: 1(0,0)
Pad_e219
  round 1.016 hole 0.762: 1(0,0)
Pad_e260
  round 1.016 hole 0.762: 1(0,0)
Pad_e269
  round 1.016 hole 0.762: 1(0,0)
Pad_e295
  round 1.016 hole 0.762: 1(0,0)
Pad_e446
  round 1.016 hole 0.762: 1(0,0)
Pad_e674
  round 1.016 hole 0.762: 1(0,0)
Pad_e678
  round 1.016 hole 0.762: 1(0,0)
Pad_e3050
  round 4.064 hole 3.048: 1(0,0)
Pad_e3495
  round 4.064 hole 3.048: 1(0,0)
Pad_e3498
  round 4.064 hole 3.048: 1(0,0)
Pad_e3500
  round 4.064 hole 3.048: 1(0,0)
Pad_e3501
  round 4.064 hole 3.048: 2(0,0)
Pad_e3502
  round 4.064 hole 3.048: 3(0,0)
Pad_e3503
  round 4.064 hole 3.048: 4(0,0)
Pad_e3506
  round 4.064 hole 3.048: 1(0,0)
Pad_e3507
  round 4.064 hole 3.048: 2(0,0)
Pad_e3508
  round 4.064 hole 3.048: 3(0,0)
Pad_e3509
  round 4.064 hole 3.048: 4(0,0)
Pad_e3510
  round 4.064 hole 3.048: 5(0,0)
Pad_e3512
  round 4.064 hole 3.048: 1(0,0)
Pad_e3513
  round 4.064 hole 3.048: 2(0,0)
Pad_e3514
  round 4.064 hole 3.048: 3(0,0)
Pad_e3517
  round 4.064 hole 3.048: 1(0,0)
Pad_e26450
  round 0.762 hole 0.508: 1(0,0)
Pad_e26454
  round 0.762 hole 0.508: 1(0,0)
Pad_e26461
  round 0.762 hole 0.508: 2(0,0)
Pad_e26470
  round 0.762 hole 0.508: 1(0,0)
Pad_e26541
  round 0.762 hole 0.508: 1(0,0)
R0805
  rect 1.133x1.377 smd: 1(-1,0) 2(1,0)
R_AXIAL-0.4
  round 1.879 hole 0.899: 1(-5.08,0) 2(5.08,0)
SOT-223-3_L6.5-W3.4-P2.30-LS7.0-BR
  rect 2.5x1.1 smd: 1(2.97,-2.3) 2(2.97,0) 3(2.97,2.3)
  rect 2.34x3.6 smd: 4(-2.97,0)
SW-SMD_4P-L6.0-W6.0-P4.50-LS9.0-H7.3
  rect 1.8x1 smd: 1(-4.2,2.25) 2(4.2,2.25) 3(-4.2,-2.25) 4(4.2,-2.25)
TO-263-5_L10.2-W8.9-P1.70-TL
  rect 3.2x1.15 smd: 1(-5.008,3.404) 2(-5.008,1.702) 3(-5.008,0) 4(-5.008,-1.702) 5(-5.008,-3.404)
  custom 8.128x10.922 smd: 6(5.008,-0.318)
WIFI-SMD_ESP32-WROOM-32E
  rect 0.95x2.1 smd: 1(-9.002,-9) 2(-7.732,-9) 3(-6.463,-9) 4(-5.192,-9) 5(-3.922,-9) 6(-2.652,-9) 7(-1.383,-9) 8(-0.113,-9) 9(1.157,-9) 10(2.428,-9) 11(3.697,-9) 12(4.968,-9) 13(6.237,-9) 14(7.508,-9) 25(7.508,9) 26(6.237,9) 27(4.968,9) 28(3.697,9) 29(2.428,9) 30(1.157,9) 31(-0.113,9) 32(-1.383,9) 33(-2.652,9) 34(-3.922,9) 35(-5.192,9) 36(-6.463,9) 37(-7.732,9) 38(-9.002,9)
  rect 2.1x0.95 smd: 15(9.002,-5.715) 16(9.002,-4.445) 17(9.002,-3.175) 18(9.002,-1.905) 19(9.002,-0.635) 20(9.002,0.635) 21(9.002,1.905) 22(9.002,3.175) 23(9.002,4.445) 24(9.002,5.715)
  rect 0.9x0.9 smd: 39(-2.721,-0.1) 39(-2.721,-1.5) 39(-2.721,-2.9) 39(-1.321,-0.1) 39(-1.321,-1.5) 39(-1.321,-2.9) 39(0.079,-0.1) 39(0.079,-1.5) 39(0.079,-2.9)

## Nets
3.3V: C9.1 C10.1 C11.1 C12.1 C13.1 C14.1 C18.1 C19.1 CN1.1 ESP32.2 LED1.1 NOREF.1 NOREF#17.1 NOREF#23.1 NOREF#24.1 P1.1 R7.1 R8.1 R11.1 R16.1 U2.2 U5.9 U5.24 U5.36 U5.48
+5V: C4.2 C5.2 C6.2 C8.2 L1.2 R4.2 U2.3
GND: C1.1 C2.1 C4.1 C5.1 C8.1 C9.2 C10.2 C11.2 C12.2 C13.2 C14.2 C15.2 C16.2 C17.1 C18.2 C19.2 CN1.4 ESP32.1 ESP32.15 ESP32.38 ESP32.39 H1.3 H2.3 H3.3 H4.3 LEDARMED.2 LEDERROR.2 LEDWIFI.2 NOREF#4.1 NOREF#14.1 NOREF#16.1 NOREF#28.1 NOREF#30.1 NOREF#31.1 NOREF#33.1 NOREF#34.2 NOREF#35.2 P1.2 P1.7 R5.1 R6.1 SW3.3 SW4.3 SW5.3 SW6.3 U1.1 U2.1 U3.2 U4.1 U5.8 U5.23 U5.35 U5.47
A1: U5.31 U6.2
A2: U5.30 U6.4
BOOT: ESP32.25 SW3.2
BOOT0: NOREF#26.1 SW6.2 U5.44
CLK: CN1.2 U5.37
CLOCK1: C15.1 U5.5 X1.1
CLOCK2: C16.1 U5.6 X1.2
DIO: CN1.3 U5.34
EN: C17.2 ESP32.3 SW4.2
PA0: H1.1 U5.10
PA1: H2.1 U5.11
PA2: H3.1 U5.12
PA3: H4.1 U5.13
PB5: U5.41
PB6: P1.3 R15.2
PB7: P1.4 R14.2
RESET_STM: U5.7
$1N753: C1.2 C2.2 C3.2 NOREF#8.1 NOREF#37.1 U1.5 U4.2
$1N844: C3.1 U1.4
$1N850: L1.1 U1.3 U3.1
$1N1078: C6.1 NOREF#22.2 R4.1 R5.2 U1.2
$1N1506: LED1.2 R6.2
$2N3717: ESP32.35 R12.1
$2N3721: ESP32.34 R13.1
$2N4329: R8.2 SW3.1
$2N4589: R7.2 SW4.1
$2N4702: R11.2 SW5.1
$2N4706: SW5.2
$2N6300: P1.8
$2N7245: R12.2 U6.1
$2N7250: R13.2 U6.3
$2N8541: R14.1 U5.43
$2N8545: R15.1 U5.42
$2N11841: R16.2 SW6.1
$2N11851: ESP32.27 NOREF#5.1 NOREF#20.1 R17.1
$2N11902: LEDWIFI.1 R17.2
$2N12058: LEDERROR.1 R18.2
$2N12127: LEDARMED.1 R19.2
$2N12132: NOREF#13.1 NOREF#18.1 R18.1 U5.27
$2N12136: NOREF#7.2 NOREF#21.2 R19.1 U5.25

Pads without a net: ESP32 4 5 6 7 8 9 10 11 12 13 14 16 17 18 19 20 21 22 23 24 26 28 29 30 31 32 33 36 37; H1 2; H2 2; H3 2; H4 2; NOREF#2 1; NOREF#3 2; NOREF#6 3; NOREF#9 3; NOREF#10 1; NOREF#11 1; NOREF#12 1; NOREF#15 2; NOREF#19 1; NOREF#25 2; NOREF#27 3; NOREF#29 1; NOREF#32 4; NOREF#36 5; NOREF#38 1; NOREF#39 4; P1 5 6; SW3 4; SW4 4; SW5 4; SW6 4; U1 6; U2 4; U5 1 2 3 4 14 15 16 17 18 19 20 21 22 26 28 29 32 33 38 39 40 45 46

## Via types
v1: diameter 1.016, hole 0.762, Top Layer to Bottom Layer, 6 vias
v2: diameter 1.524, hole 0.762, Top Layer to Bottom Layer, 1 via
v3: diameter 0.61, hole 0.305, Top Layer to Bottom Layer, 5 vias
v4: diameter 0.508, hole 0.381, Top Layer to Bottom Layer, 1 via

## Routing (per net, layer and track width the routed paths; a pad name or vN(x,y) marks a point on that pad's centre or on a via; arc(x,y) is an arc through that point)
3.3V: length 227.7
  Top Layer w0.254: 60.8,51.37 60.8,50.61 62.07,49.34 C12.1 ; 54.07,79.08 54.13,79.08 ; 37.93,70.31 R7.1
  Top Layer w0.381: 53.76,51.5 U5.48 55.31,52.86 56.84,52.86 ; 58.12,52.86 56.84,52.86 ; 58.12,52.86 58.12,54.51 61.89,58.27 62.43,58.27 62.62,58.46 U5.24 65.52,58.46 C11.1 ; 58.12,52.86 60.54,52.86 60.76,52.64 60.76,52.29 60.74,52.27 60.74,51.48 ; 56.84,52.86 56.67,53.03 56.67,59.92 U5.36 56.67,60 56.67,63.91 56.71,63.95 C10.1
  Top Layer w0.762: v2(54.07,74.63) 54.07,79.08 51.65,76.66 47.91,76.66 46.02,78.55 ; v1(41.07,85.81) 41.07,99.55 41.68,100.16 ; 38.64,38.55 38.64,31.83 42.2,28.28 NOREF.1 ; 38.64,38.55 R16.1 ; 38.64,38.55 NOREF#24.1 ; 37.94,70.31 40.67,70.31 46.02,75.66 46.02,78.55 ; 62.08,47.87 62.08,47.02 60.55,45.5 R11.1 60.48,41.62 v1(60.48,28.26) ; 41.68,100.16 40.29,100.16 39.43,99.3 37.64,99.3 37.62,99.29 34.03,99.29 C18.1 ; 41.68,100.16 41.8,100.27 ESP32.2 ; v1(56.24,65.98) 56.75,65.47 C10.1 ; NOREF#23.1 51.86,17.74 C9.1 ; 46.02,78.55 C14.1 v1(44.5,80.73) ; U2.2 NOREF#17.1 ; 53.76,51.5 C13.1
  Bottom Layer w0.762: v1(56.24,65.98) 53.05,69.17 CN1.1 52.8,73.36 v2(54.07,74.63) ; v1(44.5,80.73) 41.07,84.16 v1(41.07,85.81) ; NOREF#24.1 38.64,57.87 P1.1 ; v1(60.48,28.26) 51.99,28.26 54.26,25.99 NOREF#23.1 52.86,16.34 52.86,14.04 47.29,8.47 LED1.1
+5V: length 32.5
  Top Layer w0.254: 33.49,13.74 33.49,14.25 ; 45.58,12.59 C8.2
  Top Layer w0.762: 38.75,12.59 38,11.84 35.65,11.84 35.27,11.46 33.49,13.24 33.49,13.74 30.29,13.74 C5.2 ; U2.3 48.93,8.2 45.63,11.5 C8.2 ; R4.2 35.27,11.43 ; C4.2 45.58,12.59
GND: length 506.8
  Top Layer w0.254: ESP32.39 50.85,98.11 47.4,101.56 44.77,101.56 ESP32.1 37.88,101.54 C19.2 34.03,101.29 C18.2 ; ESP32.39 ESP32.39 ; ESP32.39 ESP32.39 ESP32.39 ; SW4.3 40.26,81.74 48.02,81.74 ; 64.99,57.39 64.75,57.63 64.75,57.63 64.5,57.87 64.5,57.87 64.42,57.96 U5.23 ; 64.99,57.39 66.45,57.39 C11.2 ; 64.99,57.39 65.37,57.01 v3(65.37,55.61) ; ESP32.39 ESP32.39 ESP32.39 ESP32.39 ; ESP32.39 59.93,101.54 ESP32.38 ; 48.02,81.74 48.02,83.52 ESP32.15 48.04,87.21 50.85,90.02 ESP32.39 ESP32.39 ; 48.02,81.74 C14.2 ; U5.47 55.13,53.38 v3(54.12,53.38) 51.58,53.38 C13.2 ; C12.2 60.22,48.02 U5.8 ; ESP32.39 ESP32.39 ; SW6.3 48.05,35.7 48.05,41.1 ; NOREF#4.1 58.75,65.95 C10.2 58.75,62.61 57.22,61.08 U5.35 57.22,55.86 v3(57.42,55.66)
  Top Layer w0.381: SW4.3 40.05,86.82 37.88,88.98 32.42,88.98 29.5,86.06 29.5,76.31 C17.1 37.33,68.48 37.33,58.61 41.12,54.82 42.7,54.82 43.21,55.33 43.21,57.36 P1.2 ; 48.05,41.1 49.94,39.2 54.37,39.2 C16.2 56.91,44.71 C12.2 ; C15.2 43.86,45.93 41.94,45.93 ; 52.05,15.72 C9.2 50.83,15.72 ; NOREF#16.1 61.25,68.22 CN1.4 ; 16.43,95.48 28.11,95.48 C18.2
  Top Layer w0.508: C13.2 NOREF#30.1 41.94,45.93 ; U2.1 52.05,15.72
  Top Layer w0.762: C5.1 32.8,11.02 NOREF#31.1 ; H1.3 71.75,74.58 SW3.3 70.35,74.37 65.54,69.55 60.68,69.55 CN1.4 ; C16.2 56.91,39.51 SW5.3 56.67,36.89 56.67,26.59 58.42,24.85 58.36,24.85 ; C4.1 36.64,15.07 NOREF#14.1 37.07,16.3 50.21,16.3 50.79,15.72 50.83,15.72 49.66,14.55 C8.1 ; 52.05,15.72 53.9,15.72 55.15,16.97 NOREF#33.1 60.61,18.37 C2.1 C1.1 63.75,19.26 NOREF#35.2 92.91,19.26 H4.3 ; NOREF#28.1 29.23,5.54 R6.1 27.77,9.93 R5.1 24.26,13.38 U1.1 17.09,13.93 H3.3 ; NOREF#34.2 80.27,32.12 U4.1
  Bottom Layer w0.254: v3(65.37,55.61) 62.63,52.87 60.21,52.87 v3(57.42,55.66) 56.4,55.66 v3(54.12,53.38) ; U4.1 91.09,37.04 99.09,45.04 99.09,52.08 LEDARMED.2 LEDERROR.2 98.92,57.29 LEDWIFI.2 ; NOREF#4.1 NOREF#16.1
  Bottom Layer w0.508: NOREF#30.1 44.38,58.63 P1.2
  Bottom Layer w0.762: NOREF#35.2 76.87,19.26 80.3,22.69 NOREF#34.2 ; NOREF#28.1 36.48,5.54 36.74,5.8 36.74,7.07 NOREF#31.1 35.85,14.05 NOREF#14.1 ; NOREF#33.1 59.21,24.12 U3.2
A1: length 26.7
  Top Layer w0.254: U6.2 78.59,72.41 70.9,72.41 59.22,60.72 U5.31
A2: length 23.7
  Top Layer w0.254: U6.4 77.18,71.14 74.7,71.14 62.26,58.69 60.23,58.69 59.72,59.2 U5.30
BOOT: length 5.4
  Top Layer w0.254: SW3.2 64.99,85.03 ESP32.25
BOOT0: length 41.6
  Top Layer w0.254: SW6.2 53.13,38.17 v1(53.12,38.18) ; U5.44 47.67,54.96 44.99,52.28 41.18,52.28 39.78,50.88 39.78,43.01 NOREF#26.1
  Bottom Layer w0.254: v1(53.12,38.18) 51.21,40.09 NOREF#26.1
CLK: length 10.7
  Top Layer w0.254: U5.37 55.22,69.09 CN1.2
CLOCK1: length 15.9
  Top Layer w0.254: U5.5 58.72,50.7 55.67,47.65 51.25,47.65 X1.1 50.04,41.75
CLOCK2: length 11.5
  Top Layer w0.254: C16.1 54.92,41.75 X1.2 55.81,47.19 59.22,50.6 U5.6
DIO: length 10.9
  Top Layer w0.254: U5.34 57.72,60.98 59.75,63.01 59.75,67.22 CN1.3
EN: length 6.6
  Top Layer w0.254: C17.2 31.65,76.16 SW4.2
PA0: length 68.7
  Top Layer w0.254: v3(65.41,51.33) 64.27,50.19 61.73,50.19 61.22,50.7 U5.10
  Bottom Layer w0.254: H1.1 97.1,78.22 87.54,68.66 72.93,68.66 69.25,64.98 69.25,55.2 65.41,51.36 v3(65.41,51.33)
PA1: length 67.7
  Top Layer w0.254: U5.11 v3(61.72,55.02)
  Bottom Layer w0.254: H2.1 12.86,91.9 23.4,91.9 60.29,55.02 v3(61.72,55.02)
PA2: length 68.1
  Top Layer w0.381: U5.12 62.6,51.46 v4(63.23,50.82)
  Bottom Layer w0.381: 11.19,15.21 16.18,15.21 43.97,43.01 54.01,43.01 61.82,50.82 v4(63.23,50.82)
PA3: length 72
  Top Layer w0.381: H4.1 96.03,12.77 99.09,15.83 99.09,20.02 93.38,25.74 74.33,25.74 66.33,33.74 66.33,51.9 65.31,52.92 63.76,52.92 U5.13
PB6: length 10.3
  Top Layer w0.254: 41.94,56.09 40.67,57.36 40.67,59.14 41.43,59.9 46.02,59.9 R15.2
PB7: length 6.1
  Top Layer w0.254: R14.2 43.71,53.55 P1.4
$1N753: length 60.8
  Top Layer w0.762: NOREF#37.1 76.77,32.12 U4.2 ; U1.5 29.85,19.51 37.12,19.51 38.64,21.04 57.2,21.04 C3.2 C2.2 C1.2 70.5,21.28 NOREF#8.1
  Bottom Layer w0.762: NOREF#8.1 70.52,23.71 76.74,29.93 NOREF#37.1
$1N844: length 31.3
  Top Layer w0.762: U1.4 29.07,16.34 30.26,16.34 31.78,17.86 38.13,17.86 39.55,19.28 C3.1
$1N850: length 37.2
  Top Layer w0.762: 49.66,24.85 49.28,25.23 29.37,25.23 25.8,21.66 25.8,17.19 28.1,15.2 31.43,15.2 31.86,15.63 32.12,15.63
$1N1078: length 20.6
  Top Layer w0.762: U1.2 v1(27.74,12.85) 29.12,11.47 R5.2 ; NOREF#22.2 35.39,6.56 R4.1 36.68,10.02 36.68,10.04
  Bottom Layer w0.762: NOREF#22.2 32.04,9.99 30.64,9.99 27.78,12.85 v1(27.74,12.85)
$1N1506: length 9.2
  Top Layer w0.762: LED1.2 37.29,5.59 R6.2
$2N3717: length 5.5
  Top Layer w0.762: ESP32.35 62.77,97.75 66.83,97.75 R12.1
$2N3721: length 6.4
  Top Layer w0.762: ESP32.34 64.82,96.46 R13.1
$2N4329: length 13
  Top Layer w0.381: R8.2 62.44,79.18 SW3.1
$2N4589: length 6
  Top Layer w0.254: SW4.1 37.93,75.34 R7.2
$2N4702: length 3.4
  Top Layer w0.381: R11.2 62.55,38.38 SW5.1
$2N7245: length 23.8
  Bottom Layer w0.381: R12.2 79.79,94.95 U6.1
$2N7250: length 20
  Bottom Layer w0.381: U6.3 78.01,74.51 R13.2
$2N8541: length 6.9
  Top Layer w0.254: U5.43 49.9,55.46 R14.1
$2N8545: length 7.8
  Top Layer w0.254: U5.42 51.96,55.96 R15.1
$2N11841: length 2.4
  Top Layer w0.762: SW6.1 44.71,36.9 R16.2
$2N11851: length 53.9
  Top Layer w0.762: NOREF#5.1 67.72,88.6 66.71,87.59 62.77,87.59 ESP32.27 ; NOREF#20.1 92.25,84.65 R17.1
  Bottom Layer w0.762: NOREF#20.1 NOREF#5.1
$2N11902: length 2.1
  Top Layer w0.254: 96.38,62.34 94.28,62.34 R17.2
$2N12058: length 2.3
  Top Layer w0.254: R18.2 LEDERROR.1
$2N12127: length 2.3
  Top Layer w0.762: LEDARMED.1 R19.2
$2N12132: length 86
  Top Layer w0.254: NOREF#13.1 61.3,61.23 61.3,60.05 U5.27
  Top Layer w0.508: NOREF#18.1 71.03,60.28 71.03,34.25 74.96,30.31 87.28,30.31 89.95,32.98 89.95,54.88 R18.1
  Bottom Layer w0.254: NOREF#13.1 63.41,63.33 NOREF#18.1
$2N12136: length 81.9
  Top Layer w0.254: U5.25 62.22,60.24 NOREF#7.2
  Top Layer w0.508: R19.1 92.23,52.12 92.23,32.98 88.17,28.91 74.33,28.91 70.01,33.23 70.01,59.77 67.98,61.8 NOREF#21.2
  Bottom Layer w0.254: NOREF#21.2 67.74,62.55 NOREF#7.2

# Board PCB7
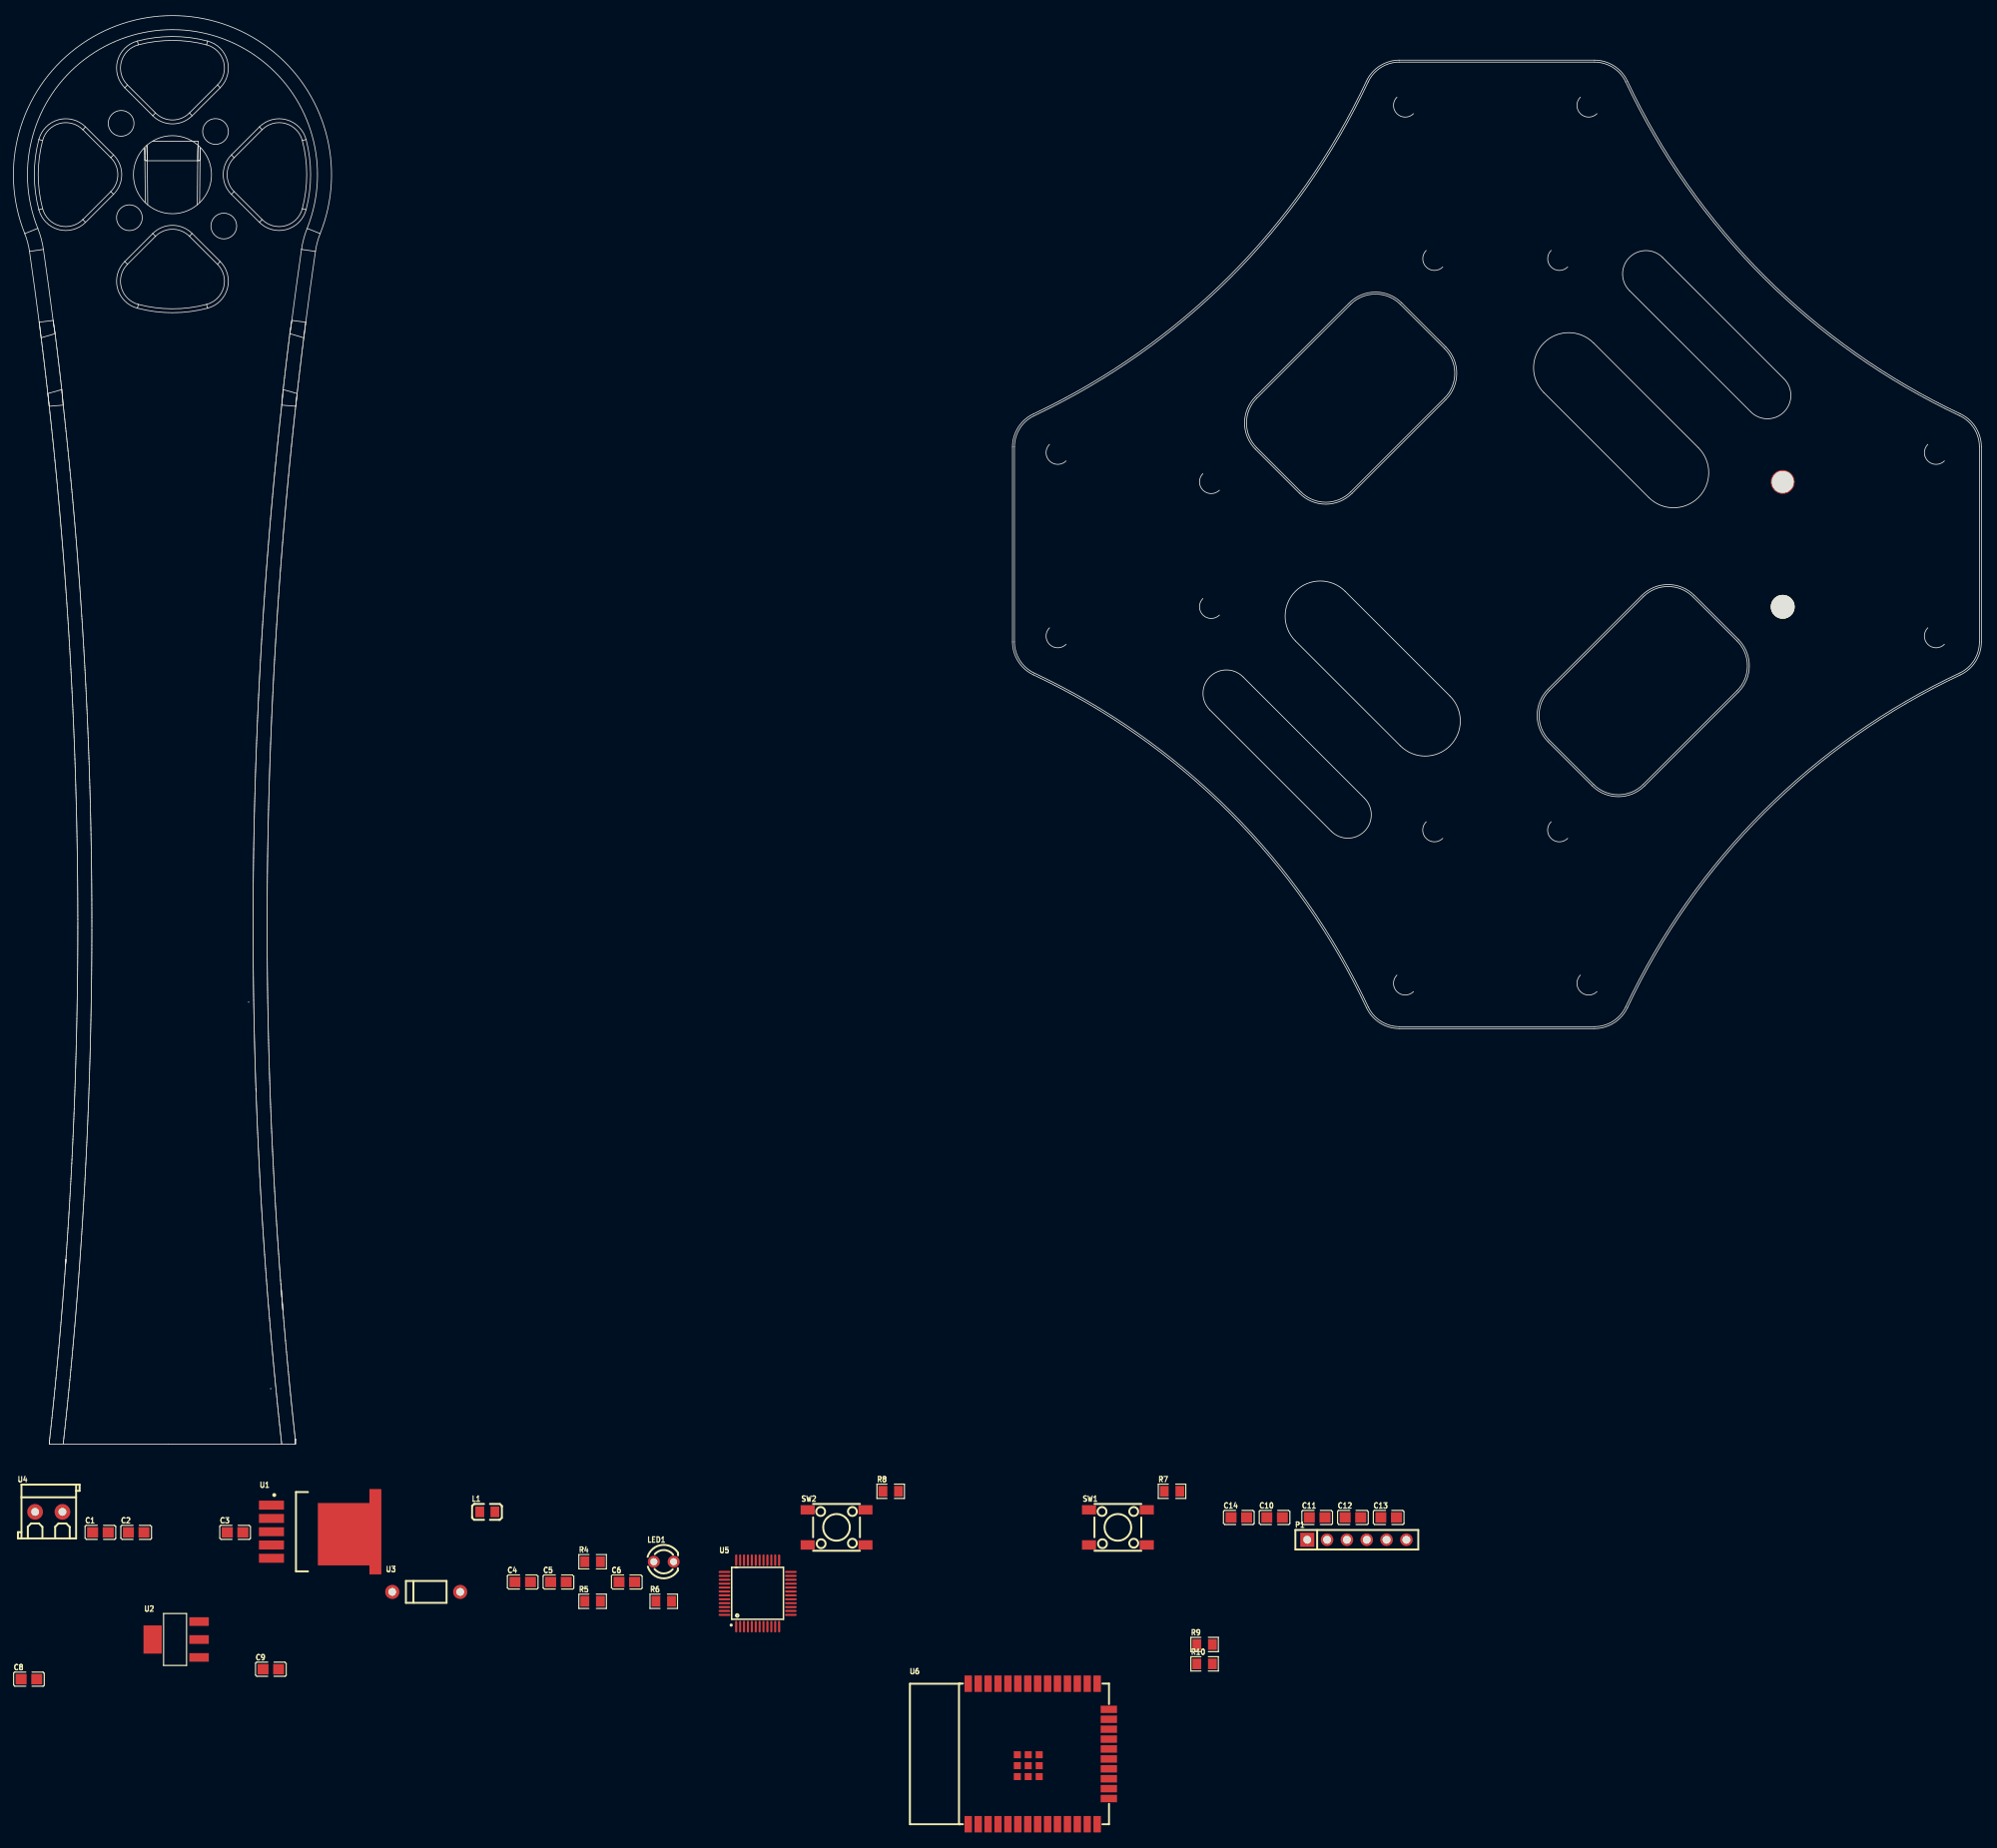
[diagram p4: board, top side]
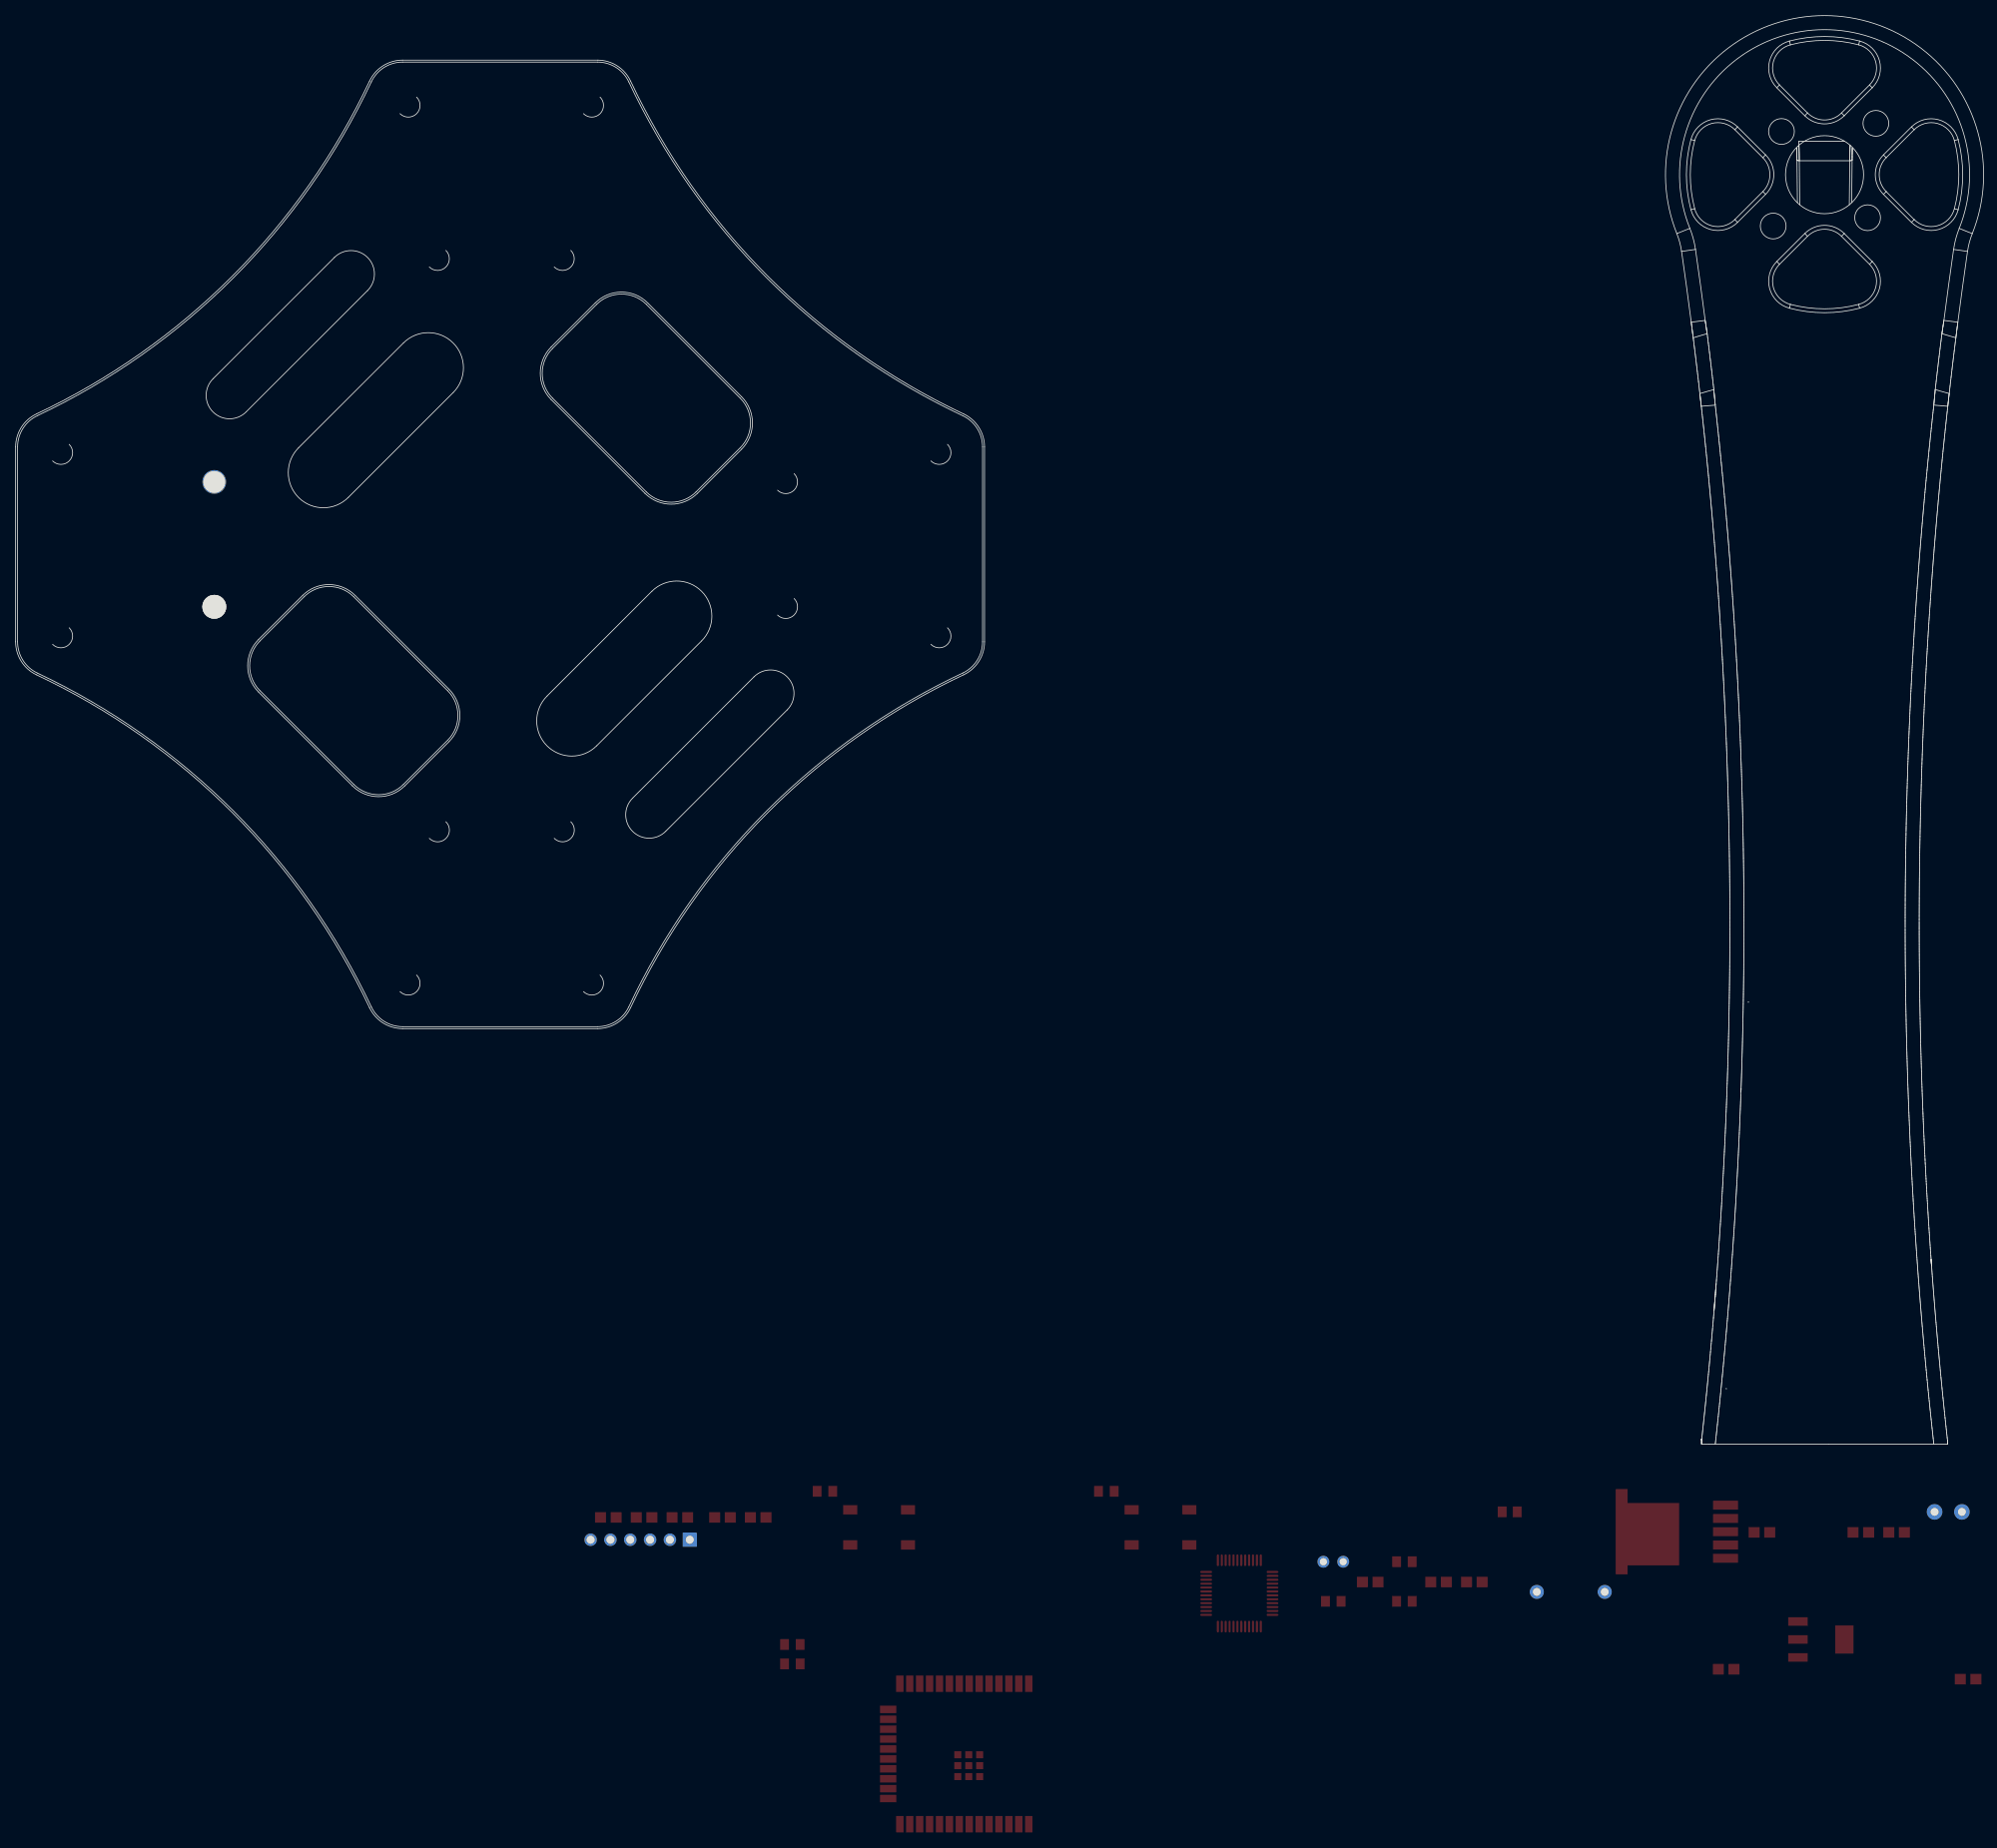
[diagram p5: board, bottom side, seen from below]

Outline 252.07 x 183.05 mm; copper layers: Top Layer, Bottom Layer. Coordinates in mm from the lower left corner of the outline.
Stack: Top Layer 0.035mm / Dielectric1 1.51mm FR4 er 4.5 / Bottom Layer 0.035mm

## Design rules (mm)
template: JLCPCB Capability(Two Layers Board)
spacing copperThickness1oz (default): track to track 0.102, other pairs 0.152 to 0.3
spacing copperThickness2oz: track to track 0.203, other pairs 0.152 to 0.3
track width copperThickness1oz (default): min 0.127, default 0.254, max 2.54
track width copperThickness2oz: min 0.203, default 0.254, max 2.54
differential pair differentialPair (default): width min 0.127, default 0.254, max 2.54; gap min 0.152, default 0.152
via viaSize (default): diameter min 0.5, default 0.61, max 10; hole min 0.3, default 0.305, max 6.3

## Placement (name value [footprint] x y rotation side)
C1  220uF  [C0805]  11.14 -11.3 0 top
C2  100uF  [C0805]  15.72 -11.3 0 top
C3  100uF  [C0805]  28.39 -11.3 0 top
C4  100uF  [C0805]  65.23 -17.66 0 top
C5  330uF  [C0805]  69.81 -17.66 0 top
C6  33uF  [C0805]  78.56 -17.66 0 top
C8  10uF  [C0805]  1.99 -30.11 0 top
C9  0.1uF  [C0805]  32.97 -28.84 0 top
C10  100uF  [C0805]  161.53 -9.39 0 top
C11  100uF  [C0805]  166.99 -9.39 0 top
C12  100uF  [C0805]  171.57 -9.39 0 top
C13  100uF  [C0805]  176.15 -9.39 0 top
C14  100uF  [C0805]  156.95 -9.39 0 top
L1  47uH  [L0805]  60.7 -8.68 0 top
LED1  -  [LED-TH_BD3.0-P2.54-FD]  83.29 -15.07 0 top
NOREF  -  [Pad_e236]  226.62 107.3 0 top
NOREF#2  -  [Pad_e235]  226.62 123.3 0 top
P1  2.54-1*6P母  [HDR-TH_6P-P2.54-V-F]  172.07 -12.25 0 top
R4  10K  [R0805]  74.19 -15.07 0 top
R5  3.3K  [R0805]  74.19 -20.14 0 top
R6  330  [R0805]  83.29 -20.14 0 top
R7  10K  [R0805]  148.4 -6.04 0 top
R8  10K  [R0805]  112.36 -6.04 0 top
R9  1K  [R0805]  152.58 -25.67 0 top
R10  1K  [R0805]  152.58 -28.16 0 top
SW1  LXW-TS-6X6X65-SMD  [SW-SMD_4P-L6.0-W6.0-P4.50-LS8.0]  141.46 -10.66 0 top
SW2  LXW-TS-6X6X65-SMD  [SW-SMD_4P-L6.0-W6.0-P4.50-LS8.0]  105.43 -10.66 0 top
U1  XL4015E1  [TO-263-5_L10.2-W8.9-P1.70-TL]  38.05 -11.22 0 top
U2  LM1117S-3.3  [SOT-223-3_L6.5-W3.4-P2.30-LS7.0-BR]  20.8 -25.03 0 top
U3  1N4736A-T50A  [DO-41_BD2.4-L4.7-P8.70-D0.9-RD]  52.88 -18.93 0 top
U4  KF350-3.5-2P  [CONN-TH_P3.50_KF350-3.5-2P]  4.53 -8.68 0 top
U5  STM32F103C8T6  [LQFP-48_L7.0-W7.0-P0.50-LS9.0-BL]  95.33 -19.13 0 top
U6  2.4GHz  [WIFI-SMD_ESP32-WROOM-32E]  131.3 -39.7 0 top

## Footprints (pads in the part's own frame, mm; a bottom-side part is the same pattern mirrored in y, then rotated)
C0805
  rect 1.41x1.35 smd: 1(-1,0) 2(1,0)
CONN-TH_P3.50_KF350-3.5-2P
  round 2 hole 1: 1(-1.75,0) 2(1.75,0)
DO-41_BD2.4-L4.7-P8.70-D0.9-RD
  round 1.8 hole 1: 1(-4.35,0) 2(4.35,0)
HDR-TH_6P-P2.54-V-F
  rect 1.8x1.8 hole 1.02: 1(-6.35,0)
  round 1.6 hole 1.02: 2(-3.81,0) 3(-1.27,0) 4(1.27,0) 5(3.81,0) 6(6.35,0)
L0805
  rect 1.133x1.377 smd: 1(-0.966,0) 2(0.966,0)
LED-TH_BD3.0-P2.54-FD
  round 1.524 hole 0.914: 1(-1.27,0) 2(1.27,0)
LQFP-48_L7.0-W7.0-P0.50-LS9.0-BL
  oval 0.27x1.5 smd: 1(-2.75,-4.25) 2(-2.25,-4.25) 3(-1.75,-4.25) 4(-1.25,-4.25) 5(-0.75,-4.25) 6(-0.25,-4.25) 7(0.25,-4.25) 8(0.75,-4.25) 9(1.25,-4.25) 10(1.75,-4.25) 11(2.25,-4.25) 12(2.75,-4.25) 25(2.75,4.25) 26(2.25,4.25) 27(1.75,4.25) 28(1.25,4.25) 29(0.75,4.25) 30(0.25,4.25) 31(-0.25,4.25) 32(-0.75,4.25) 33(-1.25,4.25) 34(-1.75,4.25) 35(-2.25,4.25) 36(-2.75,4.25)
  oval 1.5x0.27 smd: 13(4.25,-2.75) 14(4.25,-2.25) 15(4.25,-1.75) 16(4.25,-1.25) 17(4.25,-0.75) 18(4.25,-0.25) 19(4.25,0.25) 20(4.25,0.75) 21(4.25,1.25) 22(4.25,1.75) 23(4.25,2.25) 24(4.25,2.75) 37(-4.25,2.75) 38(-4.25,2.25) 39(-4.25,1.75) 40(-4.25,1.25) 41(-4.25,0.75) 42(-4.25,0.25) 43(-4.25,-0.25) 44(-4.25,-0.75) 45(-4.25,-1.25) 46(-4.25,-1.75) 47(-4.25,-2.25) 48(-4.25,-2.75)
Pad_e235
  round 3.048 hole 2.794: 1(0,0)
Pad_e236
  round 3.048 hole 3.048: 1(0,0)
R0805
  rect 1.133x1.377 smd: 1(-1,0) 2(1,0)
SOT-223-3_L6.5-W3.4-P2.30-LS7.0-BR
  rect 2.5x1.1 smd: 1(2.97,-2.3) 2(2.97,0) 3(2.97,2.3)
  rect 2.34x3.6 smd: 4(-2.97,0)
SW-SMD_4P-L6.0-W6.0-P4.50-LS8.0
  rect 1.8x1.2 smd: 1(-3.7,2.25) 2(3.7,2.25) 3(-3.7,-2.25) 4(3.7,-2.25)
TO-263-5_L10.2-W8.9-P1.70-TL
  rect 3.2x1.15 smd: 1(-5.008,3.404) 2(-5.008,1.702) 3(-5.008,0) 4(-5.008,-1.702) 5(-5.008,-3.404)
  custom 8.128x10.922 smd: 6(5.008,-0.318)
WIFI-SMD_ESP32-WROOM-32E
  rect 0.95x2.1 smd: 1(-9.002,-9) 2(-7.732,-9) 3(-6.463,-9) 4(-5.192,-9) 5(-3.922,-9) 6(-2.652,-9) 7(-1.383,-9) 8(-0.113,-9) 9(1.157,-9) 10(2.428,-9) 11(3.697,-9) 12(4.968,-9) 13(6.237,-9) 14(7.508,-9) 25(7.508,9) 26(6.237,9) 27(4.968,9) 28(3.697,9) 29(2.428,9) 30(1.157,9) 31(-0.113,9) 32(-1.383,9) 33(-2.652,9) 34(-3.922,9) 35(-5.192,9) 36(-6.463,9) 37(-7.732,9) 38(-9.002,9)
  rect 2.1x0.95 smd: 15(9.002,-5.715) 16(9.002,-4.445) 17(9.002,-3.175) 18(9.002,-1.905) 19(9.002,-0.635) 20(9.002,0.635) 21(9.002,1.905) 22(9.002,3.175) 23(9.002,4.445) 24(9.002,5.715)
  rect 0.9x0.9 smd: 39(-2.721,-0.1) 39(-2.721,-1.5) 39(-2.721,-2.9) 39(-1.321,-0.1) 39(-1.321,-1.5) 39(-1.321,-2.9) 39(0.079,-0.1) 39(0.079,-1.5) 39(0.079,-2.9)

## Nets
3.3V: C9.1 C10.1 C11.1 C12.1 C13.1 C14.1 LED1.1 R7.1 R8.1 SW1.2 SW2.2 U2.2 U5.9 U5.24 U5.36 U5.48 U6.2
+5V: C4.2 C5.2 C6.2 C8.2 L1.2 R4.2 U2.3
GND: C1.1 C2.1 C4.1 C5.1 C8.1 C9.2 C10.2 C11.2 C12.2 C13.2 C14.2 R5.1 R6.1 SW1.3 SW2.3 U1.1 U2.1 U3.2 U4.1 U5.8 U5.23 U5.35 U5.47 U6.1 U6.15 U6.38
A1: R9.2 U5.31
A2: R10.2 U5.30
BOOT: R8.2 U6.25
RESET: R7.2 U6.3
$1N753: C1.2 C2.2 C3.2 U1.5 U4.2
$1N844: C3.1 U1.4
$1N850: L1.1 U1.3 U3.1
$1N1078: C6.1 R4.1 R5.2 U1.2
$1N1506: LED1.2 R6.2
$2N3717: R9.1 U6.35
$2N3721: R10.1 U6.34

Pads without a net: NOREF 1; NOREF#2 1; P1 1 2 3 4 5 6; SW1 1 4; SW2 1 4; U1 6; U2 4; U5 1 2 3 4 5 6 7 10 11 12 13 14 15 16 17 18 19 20 21 22 25 26 27 28 29 32 33 34 37 38 39 40 41 42 43 44 45 46; U6 4 5 6 7 8 9 10 11 12 13 14 16 17 18 19 20 21 22 23 24 26 27 28 29 30 31 32 33 36 37 39
